# Altium project Hardware2_Smartwatch.PrjPcb (part 1 of 3)
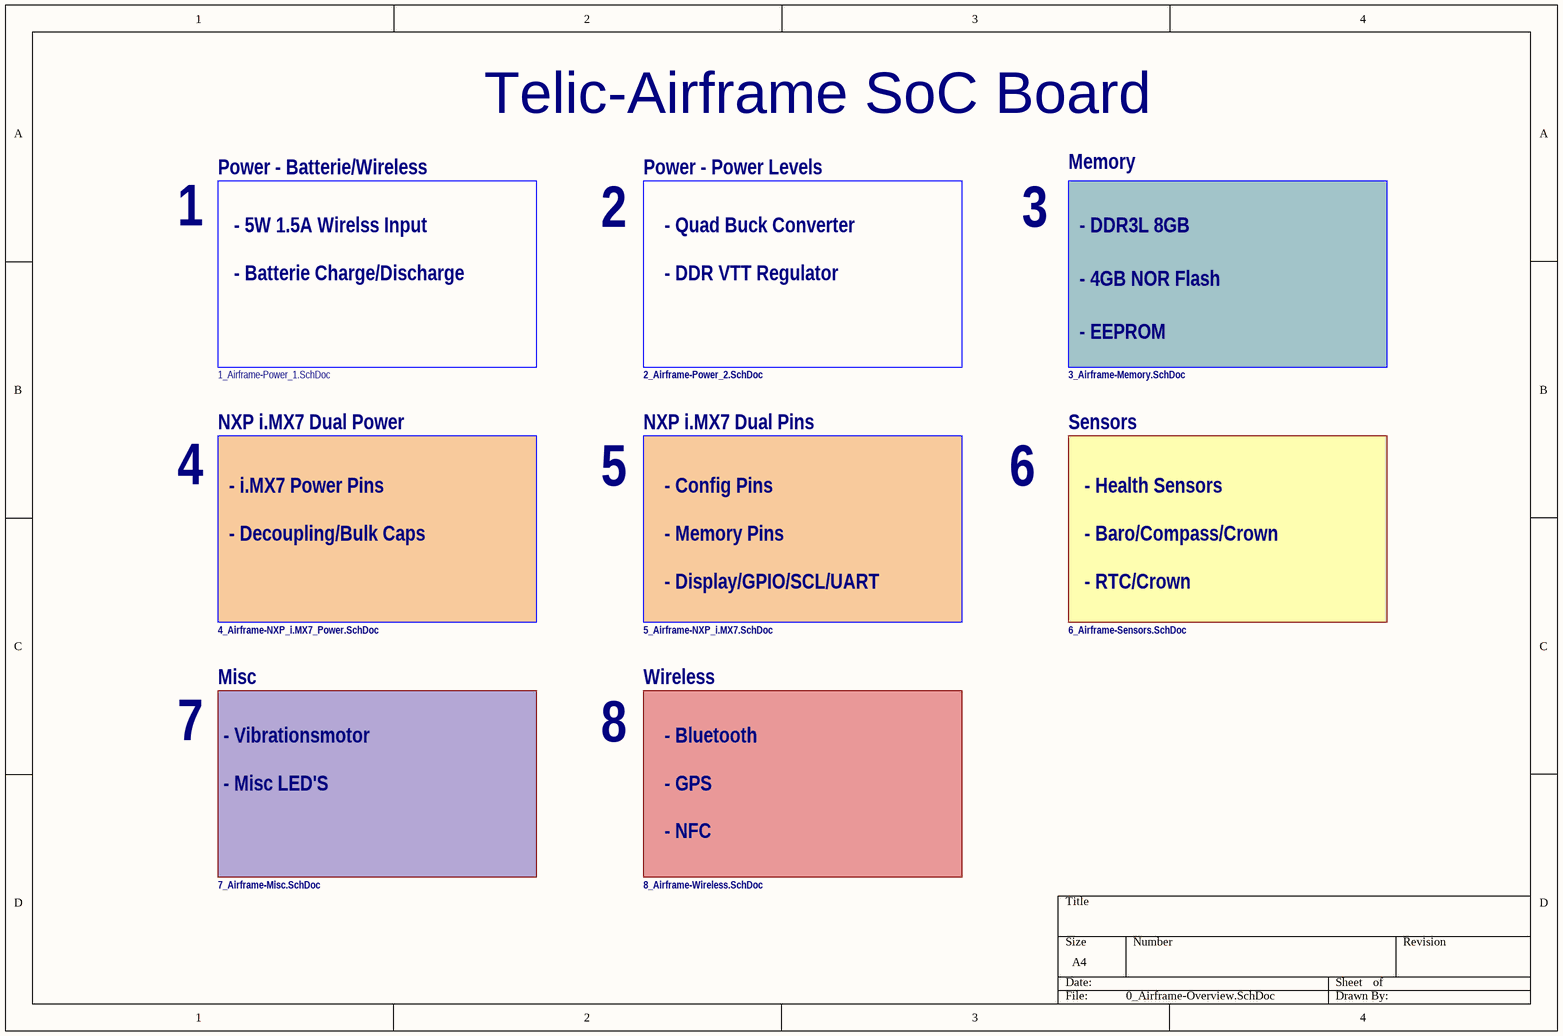
[diagram p0: 0_Airframe-Overview.SchDoc]
9 sheets, 277 parts. Net scope: global (net labels, ports and power ports of the same name join across sheets).
Board file: Prototype1.PcbDoc
Sheets:
  0_Airframe-Overview.SchDoc
  1_Airframe-Power_1.SchDoc
  2_Airframe-Power_2.SchDoc
  3_Airframe-Memory_1.SchDoc
  5_Airframe-NXP_i.MX7_Power.SchDoc
  6_Airframe-NXP_i.MX7.SchDoc
  7_Airframe-Sensors.SchDoc
  8_Airframe-Misc.SchDoc
  9_Airframe-Wireless.SchDoc

## Sheet 0_Airframe-Overview.SchDoc
size A4; SheetNumber: 1; SheetTotal: 9

### Notes on the sheet
- Power - Batterie/Wireless
- Telic-Airframe SoC Board
- Power - Power Levels
- Memory
- 1
- - 5W 1.5A Wirelss Input
- 2
- - Quad Buck Converter
- 3
- - DDR3L 8GB
- - Batterie Charge/Discharge
- - DDR VTT Regulator
- - 4GB NOR Flash
- 1_Airframe-Power_1.SchDoc
- 2_Airframe-Power_2.SchDoc
- 3_Airframe-Memory.SchDoc
- - EEPROM
- NXP i.MX7 Dual Power
- NXP i.MX7 Dual Pins
- Sensors
- 4
- - i.MX7 Power Pins
- 5
- - Config Pins
- 6
- - Health Sensors
- - Decoupling/Bulk Caps
- - Memory Pins
- - Baro/Compass/Crown
- 4_Airframe-NXP_i.MX7_Power.SchDoc
- 5_Airframe-NXP_i.MX7.SchDoc
- - Display/GPIO/SCL/UART
- 6_Airframe-Sensors.SchDoc
- - RTC/Crown
- Misc
- Wireless
- 7
- - Vibrationsmotor
- 8
- - Bluetooth
- - Misc LED'S
- - GPS
- - NFC
- 7_Airframe-Misc.SchDoc
- 8_Airframe-Wireless.SchDoc

## Sheet 1_Airframe-Power_1.SchDoc
size A4; SheetNumber: 2; SheetTotal: 9; SPICEModelCacheFLVJDJZP: <root> / <DocumentId>FLVJDJZP</DocumentId> / </root>
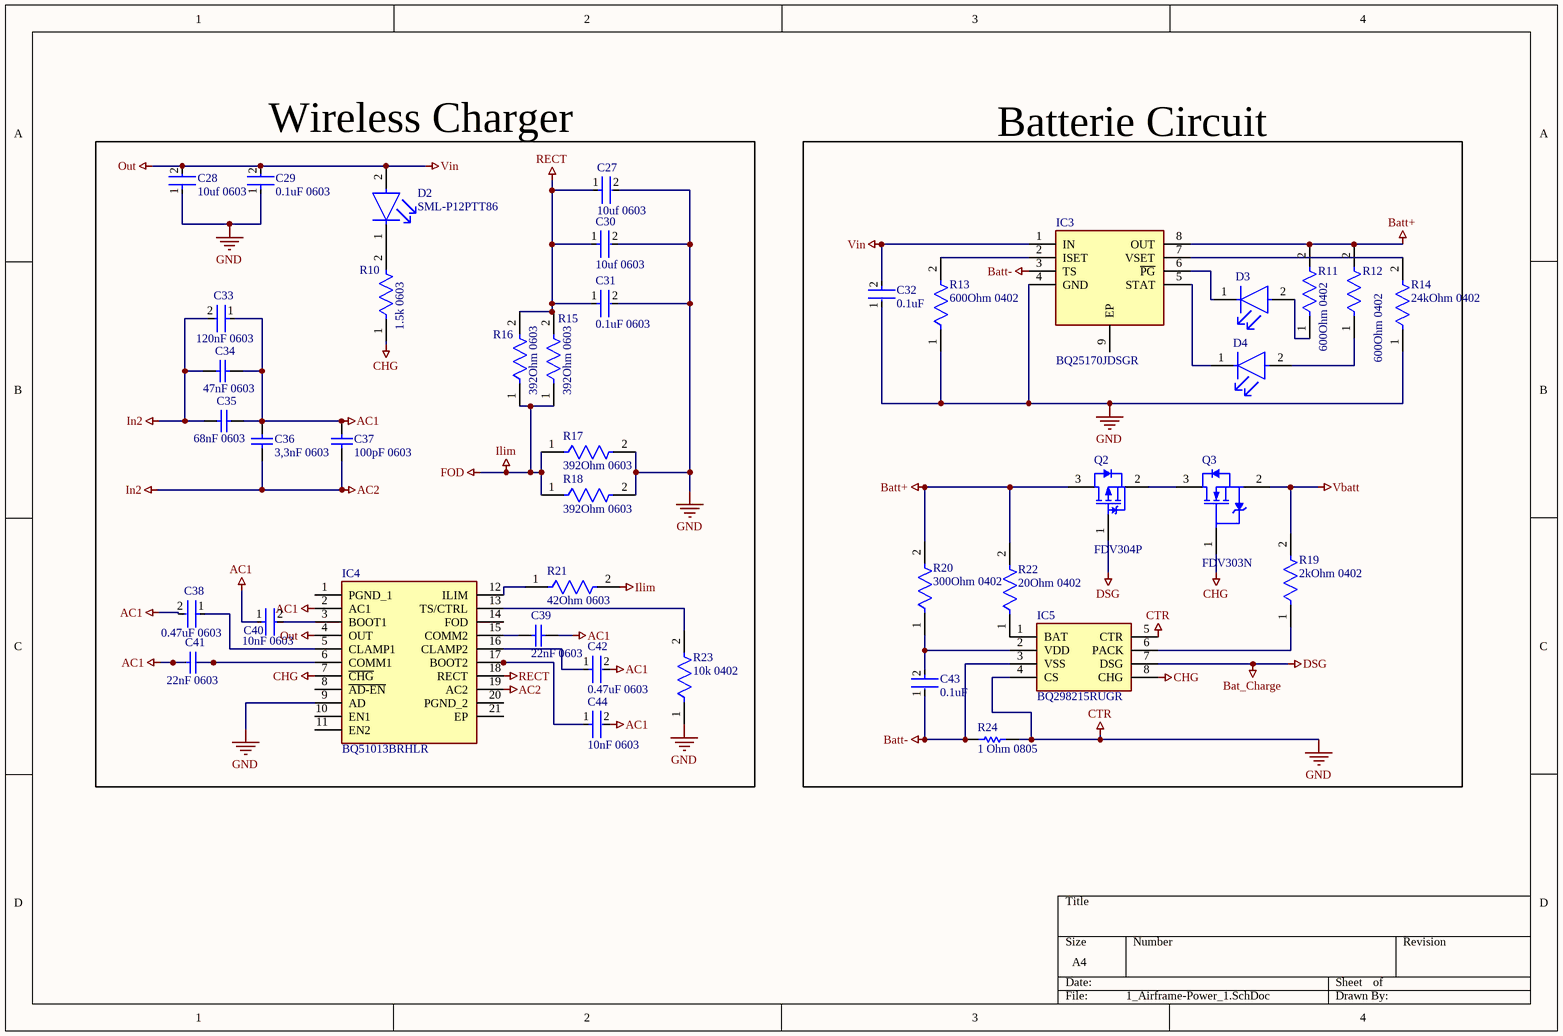
[diagram p1: 1_Airframe-Power_1.SchDoc]

### Parts
C27  10uf 0603  [FP-GRM188-0_1-e0_2_0_55-IPC_C]
C28  10uf 0603  [FP-GRM188-0_1-e0_2_0_55-IPC_C]
C29  0.1uF 0603  [FP-C0603C-CF-MFG]
C30  10uf 0603  [FP-GRM188-0_1-e0_2_0_55-IPC_C]
C31  0.1uF 0603  [FP-C0603C-CF-MFG]
C32  0.1uF  [FP-GRM15-MFG]
C33  120nF 0603  [FP-C0603C-CF-MFG]
C34  47nF 0603  [CAPC1608X90X35ML10T15]
C35  68nF 0603  [CAPC1608X90X35LL10T15]
C36  3,3nF 0603  [CAPC1608X90X35LL10T15]
C37  100pF 0603  [CAPC1608X90X35NL10T15]
C38  0.47uF 0603  [FP-GRM188-0_1-e0_2_0_5-IPC_A]
C39  22nF 0603  [CAPC1608X90X35ML10T15]
C40  10nF 0603  [FP-CC0603-DA-MFG]
C41  22nF 0603  [CAPC1608X90X35ML10T15]
C42  0.47uF 0603  [FP-GRM188-0_1-e0_2_0_5-IPC_A]
C43  0.1uF  [FP-GRM15-MFG]
C44  10nF 0603  [FP-CC0603-DA-MFG]
D2  SML-P12PTT86  [FP-SML-P1-MFG]
D3  SML-P12PTT86  [FP-SML-P1-MFG]  (value not drawn)
D4  SML-P12PTT86  [FP-SML-P1-MFG]  (value not drawn)
IC3  BQ25170JDSGR  [SON50P200X200X80-9N]
IC4  BQ51013BRHLR  [BQ51050BRHLR]
IC5  BQ298215RUGR  [BQ298215RUGR]
Q2  FDV304P  [FAIR-SOT23-3_V]
Q3  FDV303N  [FAIR-FDV303N-3_V]
R10  1.5k 0603  [FP-CRCW0402-e3-IPC_C]
R11  600Ohm 0402  [FP-CRCW0402-e3-IPC_C]
R12  600Ohm 0402  [FP-CRCW0402-e3-IPC_C]
R13  600Ohm 0402  [FP-CRCW0402-e3-IPC_C]
R14  24kOhm 0402  [FP-CRCW0402-e3-IPC_C]
R15  392Ohm 0603  [FP-CRCW0402-e3-IPC_C]
R16  392Ohm 0603  [FP-CRCW0402-e3-IPC_C]
R17  392Ohm 0603  [FP-CRCW0402-e3-IPC_C]
R18  392Ohm 0603  [FP-CRCW0402-e3-IPC_C]
R19  2kOhm 0402  [FP-CRCW0402-e3-IPC_C]
R20  300Ohm 0402  [FP-CRCW0402-e3-IPC_C]
R21  42Ohm 0603  [FP-CRCW0402-e3-IPC_C]
R22  20Ohm 0402  [FP-CRCW0402-e3-IPC_C]
R23  10k 0402  [FP-CRCW0402-e3-IPC_B]
R24  1 Ohm 0805  [RESC1609X50X30LL10T20]

### Nets
AC1: C33.1 C34.2 C35.2 C36.2 C37.2 C38.2 C39.2 C40.1 C41.2 C42.2 C44.2 IC4.2(AC1)
AC2: C33.2 C34.1 C35.1 C36.1 C37.1 IC4.19(AC2)  [also labelled In2]
Bat_Charge: IC5.7(DSG) Q2.1(G)  [also labelled DSG]
Batt+: IC3.8(OUT) Q2.3(D) R11.2 R12.2 R20.2 R22.2
Batt-: C43.1 IC3.3(TS) IC5.3(VSS) R24.1
CHG: IC4.7(~{CHG}) IC5.8(CHG) Q3.1(G) R10.1
CTR: C27.2 C28.1 C29.1 C30.2 C31.2 C32.1 IC3.4(GND) IC4.9(AD) IC5.4(CS) IC5.5(CTR) R13.1 R14.1 R17.2 R18.2 R23.1 R24.2  [also labelled GND]
FOD: R15.1 R16.1 R17.1 R18.1 R21.2  [also labelled Ilim]
Out: C28.2 C29.2 C32.2 D2.2(A) IC3.1(IN) IC4.4(OUT)  [also labelled Vin]
RECT: C27.1 C30.1 C31.1 IC4.18(RECT) R15.2 R16.2
Vbatt: Q3.2(S) R19.2
NetC38_1: C38.1 IC4.5(CLAMP1)
NetC39_1: C39.1 IC4.15(COMM2)
NetC40_2: C40.2 IC4.3(BOOT1)
NetC41_1: C41.1 IC4.6(COMM1)
NetC42_1: C42.1 IC4.16(CLAMP2)
NetC43_2: C43.2 IC5.2(VDD) R20.1
NetC44_1: C44.1 IC4.17(BOOT2)
NetD2_1: D2.1(C) R10.2
NetD3_1: D3.1(C) IC3.6(~{PG})
NetD3_2: D3.2(A) R11.1
NetD4_1: D4.1(C) IC3.5(STAT)
NetD4_2: D4.2(A) R12.1
NetIC3_2: IC3.2(ISET) R13.2
NetIC3_7: IC3.7(VSET) R14.2
NetIC4_12: IC4.12(ILIM) R21.1
NetIC4_13: IC4.13(TS/CTRL) R23.2
NetIC5_1: IC5.1(BAT) R22.1
NetIC5_6: IC5.6(PACK) R19.1
NetQ2_2: Q2.2(S) Q3.3(D)

Not connected (* = marked no-connect by the designer): IC3 9(EP); IC4 1(PGND_1) 8(~{AD-EN}) 10(EN1) 11(EN2) 14(FOD) 20(PGND_2) 21(EP)

### Notes on the sheet
- Wireless Charger
- Batterie Circuit

### Library data of the parts
C27 C28 C30 = CMP-2006-02792-2: Chip Multilayer Ceramic Capacitors for General Purpose, 0603, 10uF, X5R, 15%, 20%, 6.3V; Packaging: Tape and Reel; Voltage Rating (DC): 6.3V; Width: 0.031inch; Termination: SMD/SMT; Dielectric: X5R; Package Quantity: 4000; Voltage Rating: 6.3V; Capacitance: 10uF; Case/Package: 0603; Min Operating Temperature: -55°C; Voltage: 6.3V; Length: 1.6mm; Thickness: 0.035inch; Lead Free: Lead Free; Depth: 0.8mm; Case Code (Imperial): 0603; Max Operating Temperature: 85°C; Material: Ceramic; Height: 0.8mm; Tolerance: 20%; Mount: Surface Mount; REACH SVHC: No SVHC; Radiation Hardening: No; Case Code (Metric): 1608
C29 C31 = CMP-2006-03061-2: CAP CER 0.1UF 50V X7R 0603; Manufacturer: KEMET; Manufacturer Part Number: C0603C104K5RACTU; Tolerance: 0.1; Temperature Coefficient: 30ppm/°C; Material: Ceramic; Automotive Grade: Grade 1; Value: 0.10 μF; Temperature: -55°C to +125°C; RoHS: TRUE; Temperature Range High: +125°C; Lead Free: Yes; Octopart: https://octopart.com/c0603c104k5ractu-kemet-139244; Digikey Description: CAP CER 0.1UF 50V X7R 0603; Category: Cap; Package: C0603C-CF; ComponentLink2Description: Datasheet; Temperature Range Low: -55°C; Device Class L1: Passive Components; Voltage Rating: 50 V; Automotive: Yes; Device Class L3: Ceramic Capacitors; ComponentLink2URL: https://api.kemet.com/component-edge/download/datasheet/C0603C100J5GACAUTO.pdf; Capacitance: 0.10 μF; Device Class L2: Capacitors; Temperature Characteristic: X7R; Height: 0.87mm
C32 C43 = CMP-2100-03641-2: CAP CER 0.1UF 16V X7R 0402; Manufacturer Part Number: GRM155R71C104KA88D; Manufacturer: Murata; Standoff Height: 0mm; Tolerance: 10%; Voltage Rating: 16Vdc; Material: Ceramic; Capacitance: 0.10μF; Value: 0.10μF; RoHS: TRUE; Temperature Characteristic: X7R; Octopart: https://octopart.com/grm155r71c104ka88d-murata-196880; Digikey Description: CAP CER 0.1UF 16V X7R 0402; Device Class L3: Ceramic Capacitors; Height: 0.55mm; ComponentLink2Description: Datasheet; Temperature Range Low: -55°C; Ipc Land Pattern Name: CAPC10050X219; ComponentLink2URL: https://search.murata.co.jp/Ceramy/image/img/A01X/G101/ENG/GRM155R71H471KA01-01A.pdf; Device Class L1: Passive Components; Lead Free: yes; Category: Cap; Package: GRM15; Temperature: -55°C to +125°C; Device Class L2: Capacitors; Temperature Range High: +125°C; Mouser Description: 0402 0.1 uF 16V ±10 % Tolerance X7R SMT Multilayer Ceramic Capacitor
C33 = CMP-1035-02605-3: 0603 C 120nF Ceramic Multilayer Capacitor; 50 V; +125degC; X7R Dielec; +/-10%; Manufacturer: KEMET; Manufacturer Part Number: C0603C124K5RACTU; Capacitance: 0.12 μF; Automotive Grade: Grade 1; Voltage Rating: 50 V; Tolerance: 0.1; Temperature Coefficient: 30ppm/°C; Value: 0.12 μF; Device Class L2: Capacitors; Package: C0603C-CF; Digikey Description: 0603 C 120nF Ceramic Multilayer Capacitor; 50 V; +125degC; X7R Dielec; +/-10%; Device Class L3: Ceramic Capacitors; Category: Cap; Material: Ceramic; Height: 0.87mm; Temperature: -55°C to +125°C; Temperature Range High: +125°C; Temperature Characteristic: X7R; Lead Free: Yes; Automotive: Yes; ComponentLink2URL: https://api.kemet.com/component-edge/download/datasheet/C0603C100J5GACAUTO.pdf; Octopart: https://octopart.com/c0603c124k5ractu-kemet-12818104; Device Class L1: Passive Components; RoHS: TRUE; ComponentLink2Description: Datasheet; Temperature Range Low: -55°C
C34 = CMP-2006-02927-1: Manufacturer: Murata; Part Number: GRM188R71H473KA61D
C35 = CMP-2006-02937-1: Part Number: GRM188R71H683KA93D; Manufacturer: Murata
C36 = CMP-2006-02916-1: Manufacturer: Murata; Part Number: GRM188R71H332KA01D
C37 = CMP-2006-02595-1: Part Number: GRM1885C1H101JA01D; Manufacturer: Murata
C38 C42 = CMP-2006-02860-2: Chip Multilayer Ceramic Capacitors for General Purpose, 0603, 0.47uF, X7R, 15%, 10%, 16V; Capacitance: 470nF; Material: Ceramic; Termination: SMD/SMT; Case Code (Imperial): 0603; Height: 0.8mm; Dielectric: X7R; Length: 1.6mm; Packaging: Tape and Reel; Mount: Surface Mount; Thickness: 0.035inch; Voltage Rating (DC): 16V; Case Code (Metric): 1608; REACH SVHC: No SVHC; Depth: 0.8mm; Number of Pins: 2; Max Operating Temperature: 125°C; Min Operating Temperature: -55°C; Width: 0.8mm; Voltage: 16V; Lead Free: Lead Free; Voltage Rating: 16V; Package Quantity: 1; Case/Package: 0603; Tolerance: 10%
C39 C41 = CMP-2006-02910-1: Manufacturer: Murata; Part Number: GRM188R71H223KA01D
C40 C44 = CMP-2100-03600-2: CAP CER 10000PF 50V X7R 0603; Manufacturer Part Number: CC0603KRX7R9BB103; Manufacturer: YAGEO; Tolerance: 0.1; Material: Ceramic; Temperature Coefficient: 15%; Mouser Description: Multilayer Ceramic Capacitor, CC Series, 0.01 - F, - 10%, X7R, 50 V, 0603 [1608 Metric]; Digikey Description: CAP CER 10000PF 50V X7R 0603; Height: 0.9mm; Category: Cap; Temperature Characteristic: X7R; Footprint Url: http://www.yageo.com/exep/pages/download/literatures/UPY-C_GEN_24.pdf; Lead Free: Yes; Voltage Rating: 50 V; Temperature: -55°C to +125°C; Device Class L3: Ceramic Capacitors; ComponentLink2Description: Datasheet; Voltage: 50 V; Package: CC0603-DA; Octopart: https://octopart.com/cc0603krx7r9bb103-yageo-192938; Automotive: No; Temperature Range High: +125°C; Temperature Range Low: -55°C; Value: 10 nF; RoHS: TRUE; Device Class L1: Passive Components; ComponentLink2URL: http://www.yageo.com/documents/recent/UPY-GPHC_X7R_6.3V-to-50V_18.pdf; Device Class L2: Capacitors; Capacitance: 10 nF
D2-D4 = CMP-08952-000020-1: LED GREEN CLEAR 1006 SMD; Manufacturer: Rohm; Led Orientation: Top View; Wavelength: 560nm; Forward Current: 20mA; Reverse Voltage: 5V; Power Dissipation: 52mW; Forward Voltage: 2.1V; Luminous Intensity: 10mcd; Device Class L1: Optoelectronics; Digikey Description: LED GREEN CLEAR 1006 SMD; Lead Free: Yes; Manufacturer Part Number: SML-P12PTT86; Temperature Range High: +85°C; Octopart: https://octopart.com/sml-p12ptt86-rohm-9290705; Device Class L2: LEDs; Colour: Green; RoHS: TRUE; Height: 0.25mm; Automotive: No; Device Class L3: unset; Temperature Range Low: -40°C; ComponentLink2Description: Datasheet; Mouser Description: Standard LEDs - SMD SMD Green 13 mcd height=0.2; Category: Diode; ComponentLink2URL: https://www.rohm.com/datasheet/SML-P12DT(R); Temperature: -40°C to +85°C; Package: SML-P1
IC3 = BQ25170JDSGR: Integrated Circuit; Manufacturer_Name: Texas Instruments; Datasheet Link: https://www.ti.com/lit/ds/symlink/bq25170j.pdf?ts=1649696800811&ref_url=https%253A%252F%252Fwww.ti.com%252Fproduct%252FBQ25170J; Height: 0.8mm; Manufacturer_Part_Number: BQ25170JDSGR; Mouser Part Number: 595-BQ25170JDSGR; Mouser Price/Stock: https://www.mouser.co.uk/ProductDetail/Texas-Instruments/BQ25170JDSGR?qs=A6eO%252BMLsxmRHugWPcRNj7A%3D%3D; Arrow Part Number: BQ25170JDSGR; Arrow Price/Stock: https://www.arrow.com/en/products/bq25170jdsgr/texas-instruments?region=nac
IC4 = BQ51013BRHLR: Integrated Circuit; Manufacturer_Name: Texas Instruments; Datasheet Link: http://www.ti.com/lit/ds/symlink/bq51013b.pdf; Manufacturer_Part_Number: BQ51013BRHLR; Mouser Part Number: 595-BQ51013BRHLR; Mouser Price/Stock: https://www.mouser.co.uk/ProductDetail/Texas-Instruments/BQ51013BRHLR?qs=y1vSg4rOnUJlN8ZPg6D5Pw%3D%3D; Arrow Part Number: BQ51013BRHLR; Arrow Price/Stock: https://www.arrow.com/en/products/bq51013brhlr/texas-instruments?region=nac
IC5 = BQ298215RUGR: Integrated Circuit; Manufacturer_Name: Texas Instruments; Datasheet Link: https://www.arrow.com/en/products/bq298215rugr/texas-instruments?region=nac; Height: 0.4mm; Manufacturer_Part_Number: BQ298215RUGR; Mouser Part Number: 595-BQ298215RUGR; Mouser Price/Stock: https://www.mouser.co.uk/ProductDetail/Texas-Instruments/BQ298215RUGR?qs=iLbezkQI%252Bsg5V9tasAPYiQ%3D%3D; Arrow Part Number: BQ298215RUGR; Arrow Price/Stock: https://www.arrow.com/en/products/bq298215rugr/texas-instruments?region=nac
Q2 = CMP-2000-06263-1: P-Channel Digital FET, -25 V, -0.46 A, 0.35 W, -55 to 150 degC, 3-Pin SOT-23, -55 to 150 degC, RoHS, Tape and Reel; Manufacturer: FairchildSemiconductor; Rad Hard: No; Typical Fall Time: 35ns; Typical Rise Time: 8ns; Channel Mode: Enhancement; Maximum Continuous Drain Current: 0.46A; RDS-on: 1100@4.5VmOhm; Maximum Drain Source Voltage: 25V; Package Version: Rev. 12, 03/2016; Typical Turn-On Delay Time: 6ns; Maximum Gate Source Voltage: 8V; Channel Type: P; Typical Turn-Off Delay Time: 55ns; Datasheet Version: Rev. E1, 08/1997; Package Description: 3-Pin Small Outline Transistor, Body 2.92 x 1.325 mm, Pitch 0.95 mm; Operating Temperature: -55to150°C; Package Reference: SOT23-3; Manufacturer URL: https://www.fairchildsemi.com/; Package URL: http://www.fairchildsemi.com/dwg/MA/MA03D.pdf; Package: 3SOT-23; Category: MOSFET; Packaging: Tape&Reel; Mounting: SurfaceMount; Datasheet URL: https://www.fairchildsemi.com/datasheets/FD/FDV304P.pdf; Mounting Technology: SurfaceMount
Q3 = CMP-2000-05111-1: N-Channel MOSFET Transistor, 8 V VGSS, 25 V VDSS, 0.68 A, -55 to 150 degC, 3-Pin SOT23, RoHS, Tape and Reel; Manufacturer: Fairchild; Typical Turn-On Delay Time: 3ns; Channel Mode: Enhancement; RDS-on: 450@4.5VmOhm; Maximum Continuous Drain Current: 0.68A; Maximum Drain Source Voltage: 25V; Rad Hard: No; Typical Fall Time: 13ns; Channel Type: N; Typical Turn-Off Delay Time: 17ns; Maximum Gate Source Voltage: 8V; Typical Rise Time: 8.5ns; Mounting: SurfaceMount; Packaging: Tape&Reel; Manufacturer URL: https://www.fairchildsemi.com/; Datasheet URL: https://datasheet.ciiva.com/22681/1845307-22681736.pdf; Package: 3SOT-23; Category: MOSFET; Operating Temperature: -55to150degC; Datasheet Version: Rev. D2, 07/2014
R10 R15-R18 R21 = CMP-2002-08122-2: RES Thick Film, 0Ω, 0.063W, 0402; Tolerance: 5%; Max Power Dissipation: 63mW; Voltage Rating: 50V; Temperature Coefficient: 100ppm/°C; Resistance: 0mR; Contact Plating: Tin; Height: 0.35mm; Radiation Hardening: No; Features: Automotive AEC-Q200; Composition: Thick Film; Width: 0.5mm; Weight: 2.3E-05oz; Termination: SMD/SMT; Packaging: Tape and Reel; Mount: Surface Mount; Case Code (Metric): 1005; Military Standard: Not; Min Operating Temperature: -55°C; Number of Terminations: 2; Package Quantity: 1; Case Code (Imperial): 0402; Depth: 0.5mm; Max Operating Temperature: 155°C; Case/Package: 0402; Power Rating: 63mW; Lead Free: Lead Free; Voltage Rating (DC): 50V; Length: 1mm
R11-R14 R19 R20 R22 = CMP-2002-08359-2: RES Thick Film, 20Ω, 1%, 0.063W, 100ppm/°C, 0402; Resistance: 20R; Voltage Rating: 50V; Max Power Dissipation: 63mW; Mount: Surface Mount; Packaging: Tape and Reel; Military Standard: Not; Height: 0.35mm; Depth: 0.5mm; Lead Free: Lead Free; Number of Terminations: 2; Contact Plating: Tin; Max Operating Temperature: 155°C; Package Quantity: 10; Termination: SMD/SMT; Min Operating Temperature: -55°C; Features: Automotive AEC-Q200; Radiation Hardening: No; Case Code (Metric): 1005; Width: 0.02inch; Composition: Thick Film; Case/Package: 0402; Case Code (Imperial): 0402; Temperature Coefficient: 100ppm/°C; Tolerance: 1%; Power Rating: 63mW; Voltage Rating (DC): 50V; Length: 1mm; Weight: 2.3E-05oz
R23 = CMP-2002-08135-2: RES SMD 10K OHM 1% 1/16W 0402; Power Rating: 63mW; Resistance: 10kR; Voltage Rating: 50V; Temperature Coefficient: 100ppm/°C; Case Code (Metric): 1005; Features: Automotive AEC-Q200; Termination: SMD/SMT; Mount: Surface Mount; Package Quantity: 10; Packaging: Tape and Reel; Case Code (Imperial): 0402; Weight: 2.3E-05oz; Lead Free: Lead Free; Width: 0.02inch; Max Power Dissipation: 63mW; Tolerance: 1%; Number of Terminations: 2; Height: 0.35mm; Number of Pins: 2; Composition: Thick Film; Length: 1mm; Voltage Rating (DC): 50V; Case/Package: 0402; Radiation Hardening: No; Contact Plating: Tin; Depth: 0.5mm; Military Standard: Not; Min Operating Temperature: -55°C; Max Operating Temperature: 155°C
R24 = CMP-1012-00171-2: Manufacturer: Vishay Dale; Part Number: CRCW06031R00FKEA

## Sheet 2_Airframe-Power_2.SchDoc
size A3; SheetNumber: 3; SheetTotal: 9
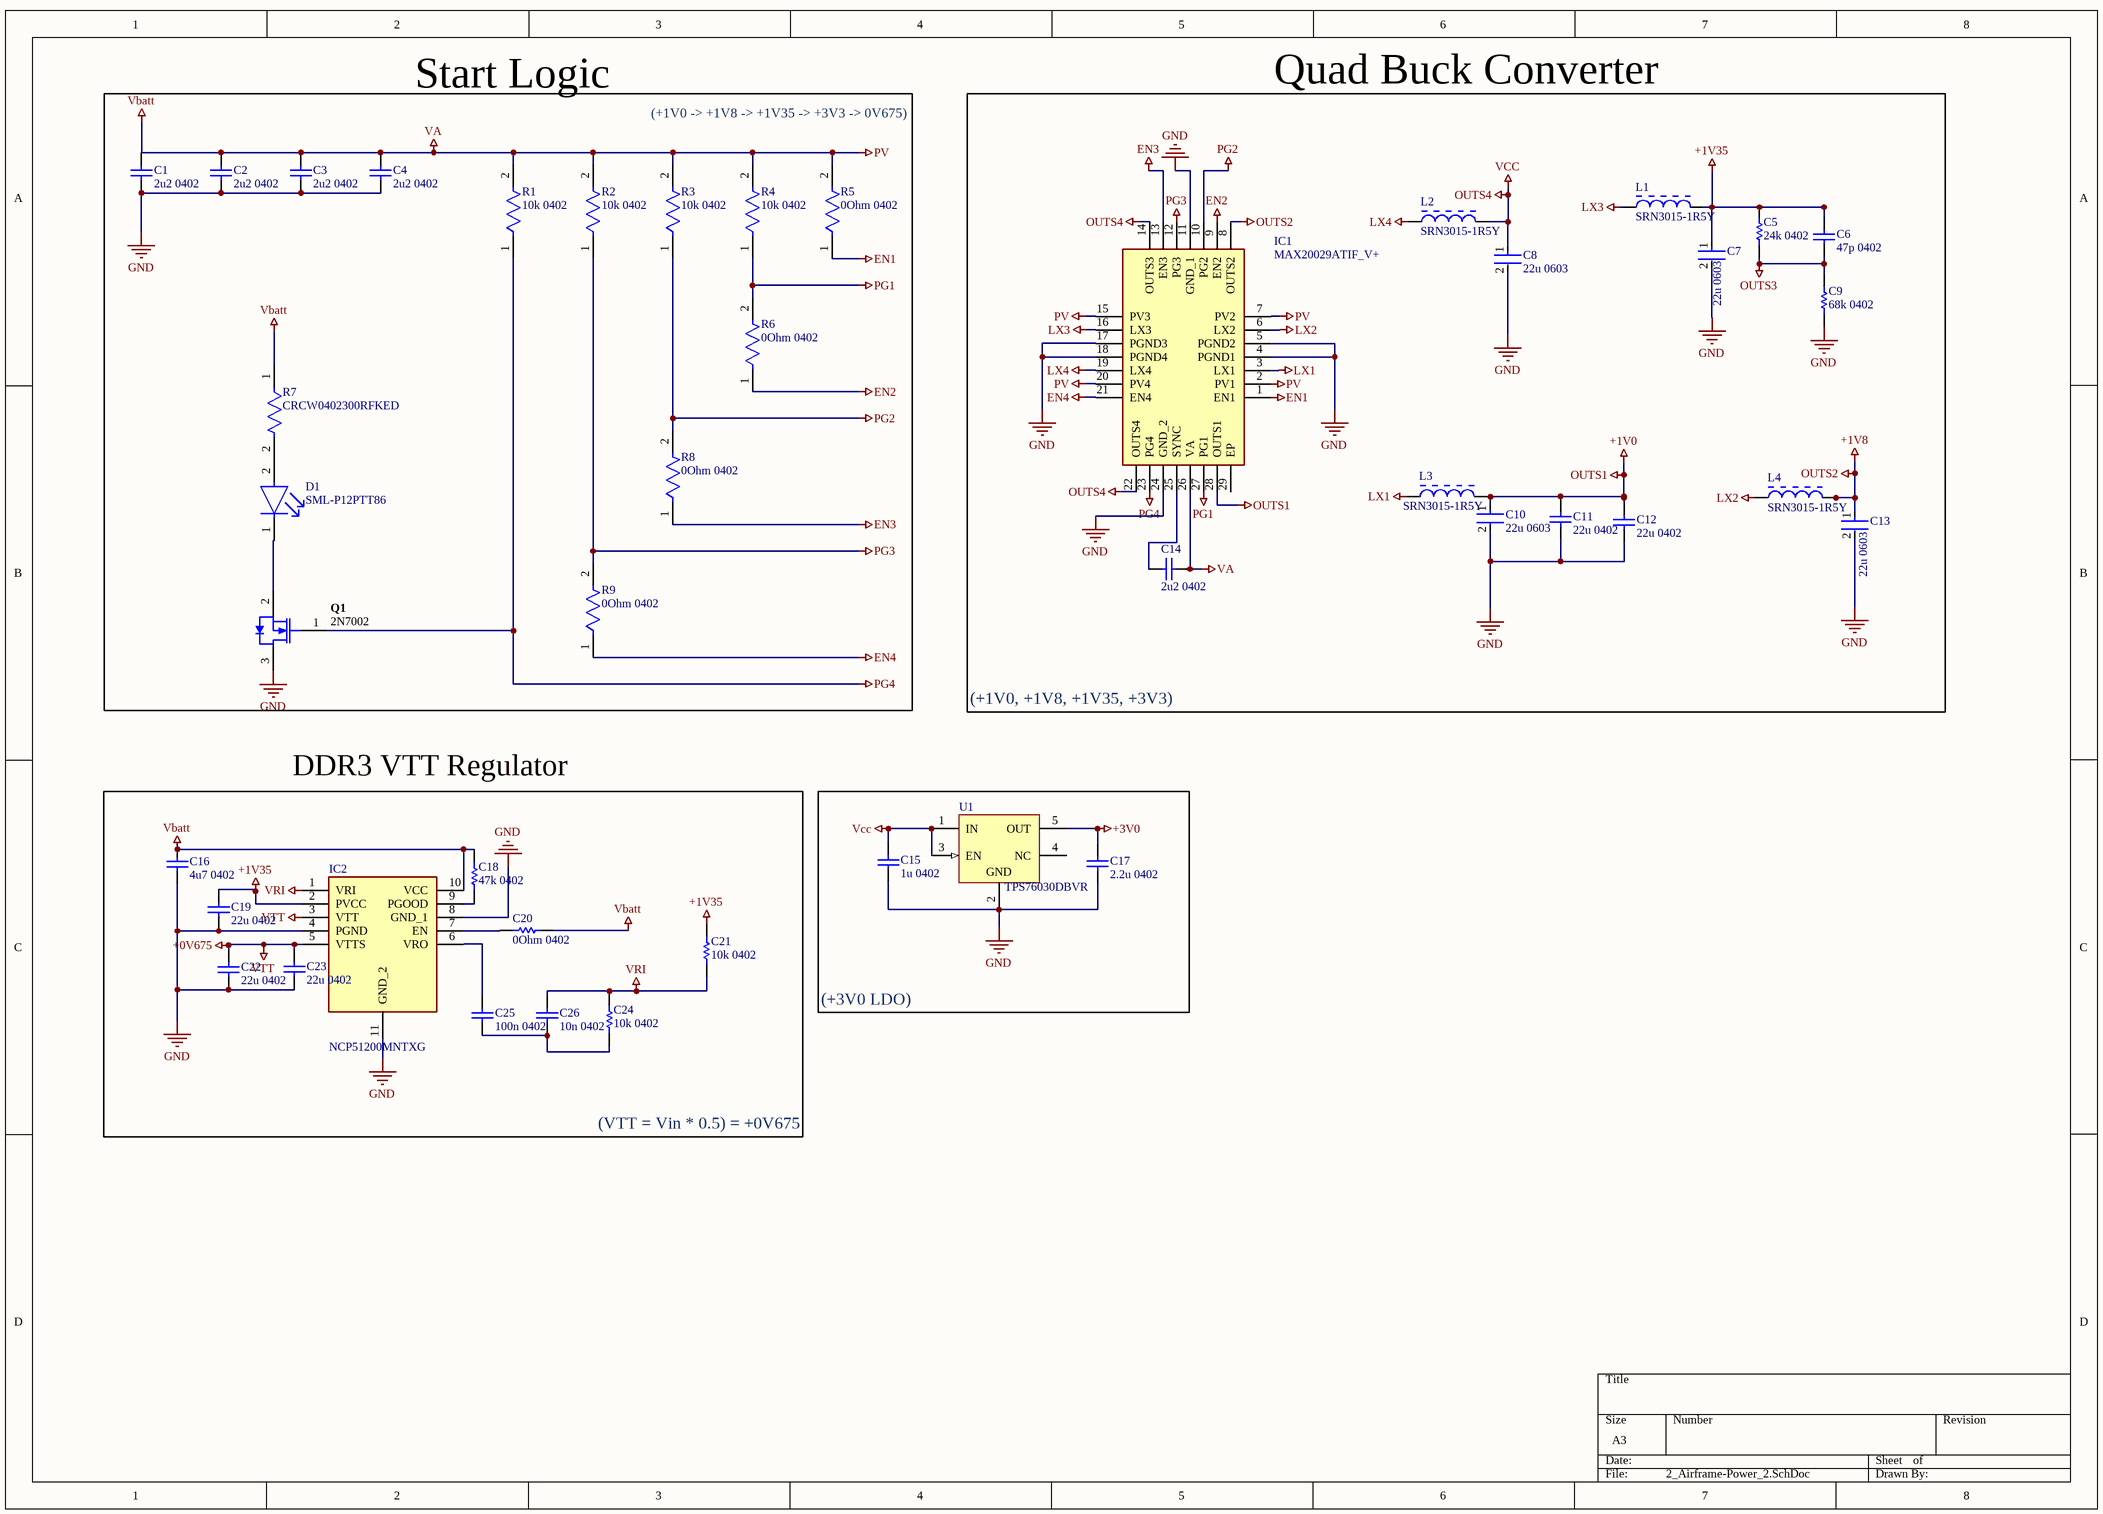
[diagram p2: 2_Airframe-Power_2.SchDoc]

### Parts
C1  2u2 0402  [CAPC1005X55X25ML5T10]
C2  2u2 0402  [CAPC1005X55X25ML5T10]
C3  2u2 0402  [CAPC1005X55X25ML5T10]
C4  2u2 0402  [CAPC1005X55X25ML5T10]
C5  24k 0402  [RESC1608X55X25ML10T15]
C6  47p 0402  [CAPC1005X55X25ML5T10]
C7  22u 0603  [FP-GRM188-0_2-IPC_C]
C8  22u 0603  [FP-GRM188-0_2-IPC_C]
C9  68k 0402  [RESC1608X55X25ML10T15]
C10  22u 0603  [FP-GRM188-0_2-IPC_C]
C11  22u 0402  [CAPC1005X55X25ML5T10]
C12  22u 0402  [CAPC1005X55X25ML5T10]
C13  22u 0603  [FP-GRM188-0_2-IPC_C]
C14  2u2 0402  [CAPC1005X55X25ML5T10]
C15  1u 0402  [CAPC1005X55X25ML5T10]
C16  4u7 0402  [CAPC1005X55X25ML5T10]
C17  2.2u 0402  [CAPC1005X55X25ML5T10]
C18  47k 0402  [RESC1608X55X25ML10T15]
C19  22u 0402  [CAPC1005X55X25ML5T10]
C20  0Ohm 0402  [RESC1608X55X25ML10T15]
C21  10k 0402  [RESC1608X55X25ML10T15]
C22  22u 0402  [CAPC1005X55X25ML5T10]
C23  22u 0402  [CAPC1005X55X25ML5T10]
C24  10k 0402  [RESC1608X55X25ML10T15]
C25  100n 0402  [CAPC1005X55X25ML5T10]
C26  10n 0402  [CAPC1005X55X25ML5T10]
D1  SML-P12PTT86  [FP-SML-P1-MFG]
IC1  MAX20029ATIF_V+  [QFN50P500X500X80-29N]
IC2  NCP51200MNTXG  [SON50P300X300X100-11N]
L1  SRN3015-1R5Y  [BOUR-SRN3015-2_V]
L2  SRN3015-1R5Y  [BOUR-SRN3015-2_V]
L3  SRN3015-1R5Y  [BOUR-SRN3015-2_V]
L4  SRN3015-1R5Y  [BOUR-SRN3015-2_V]
Q1  2N7002  [INF-PG-SOT23_N]
R1  10k 0402  [FP-CRCW0402-e3-IPC_C]
R2  10k 0402  [FP-CRCW0402-e3-IPC_C]
R3  10k 0402  [FP-CRCW0402-e3-IPC_C]
R4  10k 0402  [FP-CRCW0402-e3-IPC_C]
R5  0Ohm 0402  [FP-CRCW0402-e3-IPC_C]
R6  0Ohm 0402  [FP-CRCW0402-e3-IPC_C]
R7  CRCW0402300RFKED  [FP-CRCW0402-e3-MFG]
R8  0Ohm 0402  [FP-CRCW0402-e3-IPC_C]
R9  0Ohm 0402  [FP-CRCW0402-e3-IPC_C]
U1  TPS76030DBVR  [DBV0005A_N]

### Blocks framed on the sheet
(+1V0 -> +1V8 -> +1V35 -> +3V3 -> 0V675): C1-C4 D1 Q1 R1-R9
(+1V0, +1V8, +1V35, +3V3): C5-C14 IC1 L1-L4
(VTT = Vin * 0.5) = +0V675: C16 C18-C26 IC2
(+3V0 LDO): C15 C17 U1

### Nets
+0V675: C22.1 C23.1 IC2.3(VTT) IC2.5(VTTS)  [also labelled VTT]
+1V0: C10.1 C11.1 C12.1 IC1.28(OUTS1) L3.2  [also labelled OUTS1]
+1V8: C13.1 IC1.8(OUTS2) L4.2  [also labelled OUTS2]
+1V35: C5.2 C6.1 C7.1 C19.1 C21.1 IC2.2(PVCC) L1.2
+3V0: C17.1 U1.5(OUT)
EN1: IC1.1(EN1) R5.1
EN2: IC1.9(EN2) R6.1
EN3: IC1.13(EN3) R8.1
EN4: IC1.21(EN4) R9.1
GND: C1.2 C2.2 C3.2 C4.2 C7.2 C8.2 C9.1 C10.2 C11.2 C12.2 C13.2 C15.2 C16.2 C17.2 C19.2 C22.2 C23.2 IC1.4(PGND1) IC1.5(PGND2) IC1.11(GND_1) IC1.17(PGND3) IC1.18(PGND4) IC1.24(GND_2) IC2.4(PGND) IC2.8(GND_1) IC2.11(GND_2) Q1.3(DRAIN) U1.2(GND)  [project net CTR]
LX1: IC1.3(LX1) L3.1
LX2: IC1.6(LX2) L4.1
LX3: IC1.16(LX3) L1.1
LX4: IC1.19(LX4) L2.1
OUTS3: C5.1 C6.2 C9.2
OUTS4: C8.1 C15.1 IC1.14(OUTS3) IC1.22(OUTS4) L2.2 U1.1(IN) U1.3(EN)  [also labelled VCC]  [project net +VS]
PG1: IC1.27(PG1) R4.1 R6.2
PG2: IC1.10(PG2) R3.1 R8.2
PG3: IC1.12(PG3) R2.1 R9.2
PG4: IC1.23(PG4) Q1.1(GATE) R1.1
PV: C1.1 C2.1 C3.1 C4.1 C14.1 IC1.2(PV1) IC1.7(PV2) IC1.15(PV3) IC1.20(PV4) IC1.26(VA) R1.2 R2.2 R3.2 R4.2 R5.2  [also labelled VA]
Vbatt: C16.1 C18.2 C20.1 IC2.10(VCC) R7.1
VRI: C21.2 C24.1 C26.1 IC2.1(VRI)
NetC14_2: C14.2 IC1.25(SYNC)
NetC18_1: C18.1 IC2.9(PGOOD)
NetC20_2: C20.2 IC2.7(EN)
NetC24_2: C24.2 C25.2 C26.2
NetC25_1: C25.1 IC2.6(VRO)
NetD1_1: D1.1(C) Q1.2(SOURCE)
NetD1_2: D1.2(A) R7.2

Not connected (* = marked no-connect by the designer): IC1 29(EP); U1 4(NC)

### Notes on the sheet
- Start Logic
- Quad Buck Converter
- DDR3 VTT Regulator

### Library data of the parts
C1-C4 C6 C11 C12 C14-C17 C19 C22 C23 C25 C26 = CMP-1662-00017-1: Chip Capacitor, 1 nF, +/- 10%, 50 V, -55 to 125 degC, 0402 (1005 Metric), RoHS, Tape and Reel; Case\/Package: 0402; Type (Capacitors): X7R; Voltage Rating (DC): 50 V; Capacitance: 1 nF; Width: 0.5 mm; Pins: 2; REACH SVHC: No SVHC; Length: 1 mm; Height: 0.5 mm; PackageDescription: 2-Pin Surface Mount Device, Body 1 x 0.5 mm; DatasheetVersion: 07/2016; Mount: Surface Mount; ComponentLink2Description: Datasheet; Tolerance: 10%; ComponentLink2URL: http://psearch.en.murata.com/capacitor/product/GRM155R71H102KA01%23.pdf; ComponentLink1URL: http://www.murata.com/; Case Code (Metric): 1005; Package Quantity: 10000; Min Operating Temperature: -55 degC; Max Operating Temperature: 125 degC; Voltage Rating: 50 V; ComponentLink1Description: Manufacturer URL; Packaging: Tape and Reel; Radiation Hardening: No; RoHSCompliant: true; PackageReference: 0402; Mounting Technology: Surface Mount; Case Code (Imperial): 0402
C5 C9 C18 C20 C21 C24 = CMP-2100-03667-1: Chip Resistor, 0 Ohm, +/- 5%, 0.1 W, -55 to 155 degC, 0603 (1608 Metric), RoHS, Tape and Reel; Manufacturer: Yageo; Temperature Coefficient: 200ppm/degreesC; Voltage Rating: 50V; Power Rating: 100mW; Resistance: 0mOhm; Width: 0.8mm; Max Operating Temperature: 155degC; Tolerance: 5%; Package Reference: 0603; Height: 0.45mm; Depth: 0.8mm; Package Description: 2-Pin Surface Mount Device, Body 1.6 x 0.8 mm; Termination: SMD/SMT; Package Quantity: 5000; Case/Package: 0603; Case Code (Imperial): 0603; Radiation Hardening: No; Number of Pins: 2; Length: 1.6mm; Lead Free: LeadFree; Voltage Rating (DC): 50V; Military Standard: Not; Datasheet URL: http://www.yageo.com/NewPortal/yageodocoutput?fileName=/pdf/R-Chip/PYu-RC_Group_51_RoHS_L_5.pdf; Manufacturer URL: http://www.yageo.com/; Packaging: TapeandReel; Case Code (Metric): 1608; Min Operating Temperature: -55degC; Composition: ThickFilm; RoHSCompliant: true; Contact Plating: Tin; Datasheet Version: Rev. 5, 10/2016; REACH SVHC: NoSVHC
C7 C8 C10 C13 = CMP-2000-06337-3: Chip Multilayer Ceramic Capacitors for General Purpose, 0603, 22uF, X5R, 15%, 20%, 10V; Tolerance: 20%; Weight: 0.000222oz; Material: Ceramic; Depth: 0.8mm; Length: 1.6mm; Termination: SMD/SMT; Capacitance: 22uF; Packaging: Tape and Reel; Width: 0.8mm; Voltage Rating: 10V; Case Code (Imperial): 0603; Mount: Surface Mount; Voltage Rating (DC): 10V; Case/Package: 0603; Thickness: 0.039inch; REACH SVHC: No SVHC; Dielectric: X5R; Height: 0.8mm; Package Quantity: 4000; Case Code (Metric): 1608; Min Operating Temperature: -55°C; Lead Free: Lead Free; Max Operating Temperature: 85°C
D1 = CMP-08952-000020-1: as D2 on sheet 1_Airframe-Power_1; Device Class L1: Optoelectronics; Digikey Description: LED GREEN CLEAR 1006 SMD; Lead Free: Yes; Manufacturer Part Number: SML-P12PTT86; Temperature Range High: +85°C; Octopart: https://octopart.com/sml-p12ptt86-rohm-9290705; Device Class L2: LEDs; Colour: Green; RoHS: TRUE; Height: 0.25mm; Automotive: No; Device Class L3: unset; Temperature Range Low: -40°C; ComponentLink2Description: Datasheet; Mouser Description: Standard LEDs - SMD SMD Green 13 mcd height=0.2; Category: Diode; ComponentLink2URL: https://www.rohm.com/datasheet/SML-P12DT(R); Temperature: -40°C to +85°C; Package: SML-P1
IC1 = MAX20029ATIF_V+: Integrated Circuit; Manufacturer_Name: Maxim Integrated; Manufacturer_Part_Number: MAX20029ATIF/V+; Datasheet Link: https://datasheets.maximintegrated.com/en/ds/MAX20029-MAX20029D.pdf; Height: 0.8mm; Mouser Part Number: 700-MAX20029ATIF/V+; Mouser Price/Stock: https://www.mouser.co.uk/ProductDetail/Maxim-Integrated/MAX20029ATIF-V%2b?qs=uwxL4vQweFOl5TBKmLtmFg%3D%3D; Arrow Part Number: MAX20029ATIF/V+; Arrow Price/Stock: https://www.arrow.com/en/products/max20029atifv/maxim-integrated?region=nac
IC2 = NCP51200MNTXG: Integrated Circuit; Manufacturer_Name: onsemi; Datasheet Link: http://www.onsemi.com/pub/Collateral/NCP51200-D.PDF; Height: 1mm; Manufacturer_Part_Number: NCP51200MNTXG; Mouser Part Number: 863-NCP51200MNTXG; Mouser Price/Stock: https://www.mouser.co.uk/ProductDetail/onsemi/NCP51200MNTXG?qs=mt7EBqA2jzgnxcGILBvARw%3D%3D; Arrow Part Number: NCP51200MNTXG; Arrow Price/Stock: https://www.arrow.com/en/products/ncp51200mntxg/on-semiconductor?region=europe
L1-L4 = CMP-0007-00008-1: Semi-shielded Power Inductor, 1.5 uH, +/- 30%, 2.1 A, -40 to 125 degC, 3 x 3 x 1.5 mm SMD, RoHS and Halogen Free, Tape and Reel; Manufacturer: Bourns; SRF Min: 130 MHz; Rated current: 2.1 A; DCR Max: 0.066 Ohm; Inductance: 1.5 uH; Isat: 2 A; Inductance tolerance: +/- 30%; Resistance to Solder Heat: +260 degC for 10 sec.; RoHS: TRUE; Mounting Technology: Surface Mount; ComponentLink1Description: Manufacturer URL; ComponentLink1URL: http://www.bourns.com/; PartNumber: SRN3015-1R5Y; ComponentLink3Description: Package Specification; ComponentLink3URL: http://www.bourns.com/data/global/pdfs/SRN3015.pdf; Operating Temperature: -40 to 125 degC; PackageReference: SRN3015; DatasheetVersion: Aug-11; Packing: Tape and Reel; ComponentLink2Description: Datasheet; PackageDescription: 2-Pin SMD, Body 3 x 3 mm, Height 1.5 mm; ComponentLink2URL: http://www.bourns.com/data/global/pdfs/SRN3015.pdf
Q1 = CMP-1149-00026-1: N-Channel OptiMOS Small-Signal-Transistor, 60 V VDS, 0.3 A ID, -55 to 150 degC, PG-SOT23, Reel, Green; Manufacturer: Infineon; RDS (on) (max) (@4.5V): 4,000 mOhm; VDS (max): 60 V; IDpuls (max): 1.2Â A; QG: 0.4Â nC; RDS (on) (max): 3,000 mOhm; RthJA (max): 250 K/W; ID (max): 0.3Â A; VGS(th) (max): 2.5Â V; VGS(th) (min): 1.5Â V; Green: TRUE; Ptot (max): 0.5Â W; PackageDescription: 3-Pin Small Outline Transistor Package, 2.9 x 1.3 mm Body, 0.95 mm Pitch; Halogen-free: TRUE; ComponentLink2Description: Datasheet; ComponentLink1URL: http://www.infineon.com/; Packing: Reel; DatasheetVersion: Rev. 2.4; PartNumber: 2N7002; PackageReference: PG-SOT23; PackageVersion: Apr-08; ComponentLink3URL: http://www.infineon.com/dgdl/SOT23-Package_Overview.pdf?folderId=db3a30431936bc4b0119532290053c66&fileId=db3a30431936bc4b0119533468123c85; ComponentLink1Description: Manufacturer URL; Mounting Technology: Surface Mount; ComponentLink3Description: Package Specification; ComponentLink2URL: http://www.infineon.com/dgdl/2N7002_Rev2.4.pdf?folderId=db3a3043156fd573011622e10b5c1f67&fileId=db3a304319bc939a0119c2a9461e79e6
R1-R6 R8 R9 = CMP-2002-08122-2: as R10 on sheet 1_Airframe-Power_1; Contact Plating: Tin; Height: 0.35mm; Radiation Hardening: No; Features: Automotive AEC-Q200; Composition: Thick Film; Width: 0.5mm; Weight: 2.3E-05oz; Termination: SMD/SMT; Packaging: Tape and Reel; Mount: Surface Mount; Case Code (Metric): 1005; Military Standard: Not; Min Operating Temperature: -55°C; Number of Terminations: 2; Package Quantity: 1; Case Code (Imperial): 0402; Depth: 0.5mm; Max Operating Temperature: 155°C; Case/Package: 0402; Power Rating: 63mW; Lead Free: Lead Free; Voltage Rating (DC): 50V; Length: 1mm
R7 = CMP-2002-08497-2: RES Thick Film, 300Ω, 1%, 0.063W, 100ppm/°C, 0402; Voltage Rating: 50V; Resistance: 300R; Max Power Dissipation: 63mW; Depth: 0.5mm; Tolerance: 1%; Package Quantity: 10; Temperature Coefficient: 100ppm/°C; Features: Automotive AEC-Q200; Military Standard: Not; Case Code (Metric): 1005; Voltage Rating (DC): 50V; Case/Package: 0402; Lead Free: Lead Free; Contact Plating: Tin; Min Operating Temperature: -55°C; Length: 1mm; Number of Terminations: 2; Case Code (Imperial): 0402; Weight: 2.3E-05oz; Mount: Surface Mount; Termination: SMD/SMT; Max Operating Temperature: 155°C; Width: 0.02inch; Composition: Thick Film; Height: 0.35mm; Power Rating: 63mW; Radiation Hardening: No; Packaging: Tape and Reel
U1 = CMP-0394-00493-2: Single Output LDO, 50 mA, Fixed 3 V Output, 3.2 to 16 V Input, with Low IQ, 5-pin SOT-23 (DBV), -40 to 125 degC, Green (RoHS & no Sb/Br); Manufacturer: Texas Instruments; Accuracy(%): 2; Vin(Max)(V): 16; Iq(Typ)(mA): 0.8; Iout(Max)(A): 0.05; Vin(Min)(V): 3.2; Vout Adj(Max)(V): 3; SubFamily: Single Channel LDO; Vdo(Typ)(mV): 120; Rating: Catalog; ComponentLink1URL: http://www.ti.com/; ComponentLink1Description: Manufacturer URL; Code_JEDEC: MO-178; PackageDescription: 5-Pin Plastic Small Outline, Body 1.60 Ãƒâ€” 2.90 mm, Pitch 0.95 mm; PartNumber: TPS76030DBVR; ComponentLink2Description: Datasheet; Mounting Technology: Surface Mount; ComponentLink3Description: Package Specification; ComponentLink2URL: http://www.ti.com/general/docs/lit/getliterature.tsp?genericPartNumber=TPS76030&fileType=pdf; ComponentLink3URL: http://www.ti.com/litv/pdf/mpds018i; Eco-Plan: Green (RoHS & no Sb/Br); DatasheetVersion: SLVS144D; PackageVersion: 4073253-4/K; Fixed Output Options(V): 3; Vout Adj(Min)(V): 3; PackageReference: DBV0005A

## Sheet 3_Airframe-Memory_1.SchDoc
size A3; SheetNumber: 4; SheetTotal: 9
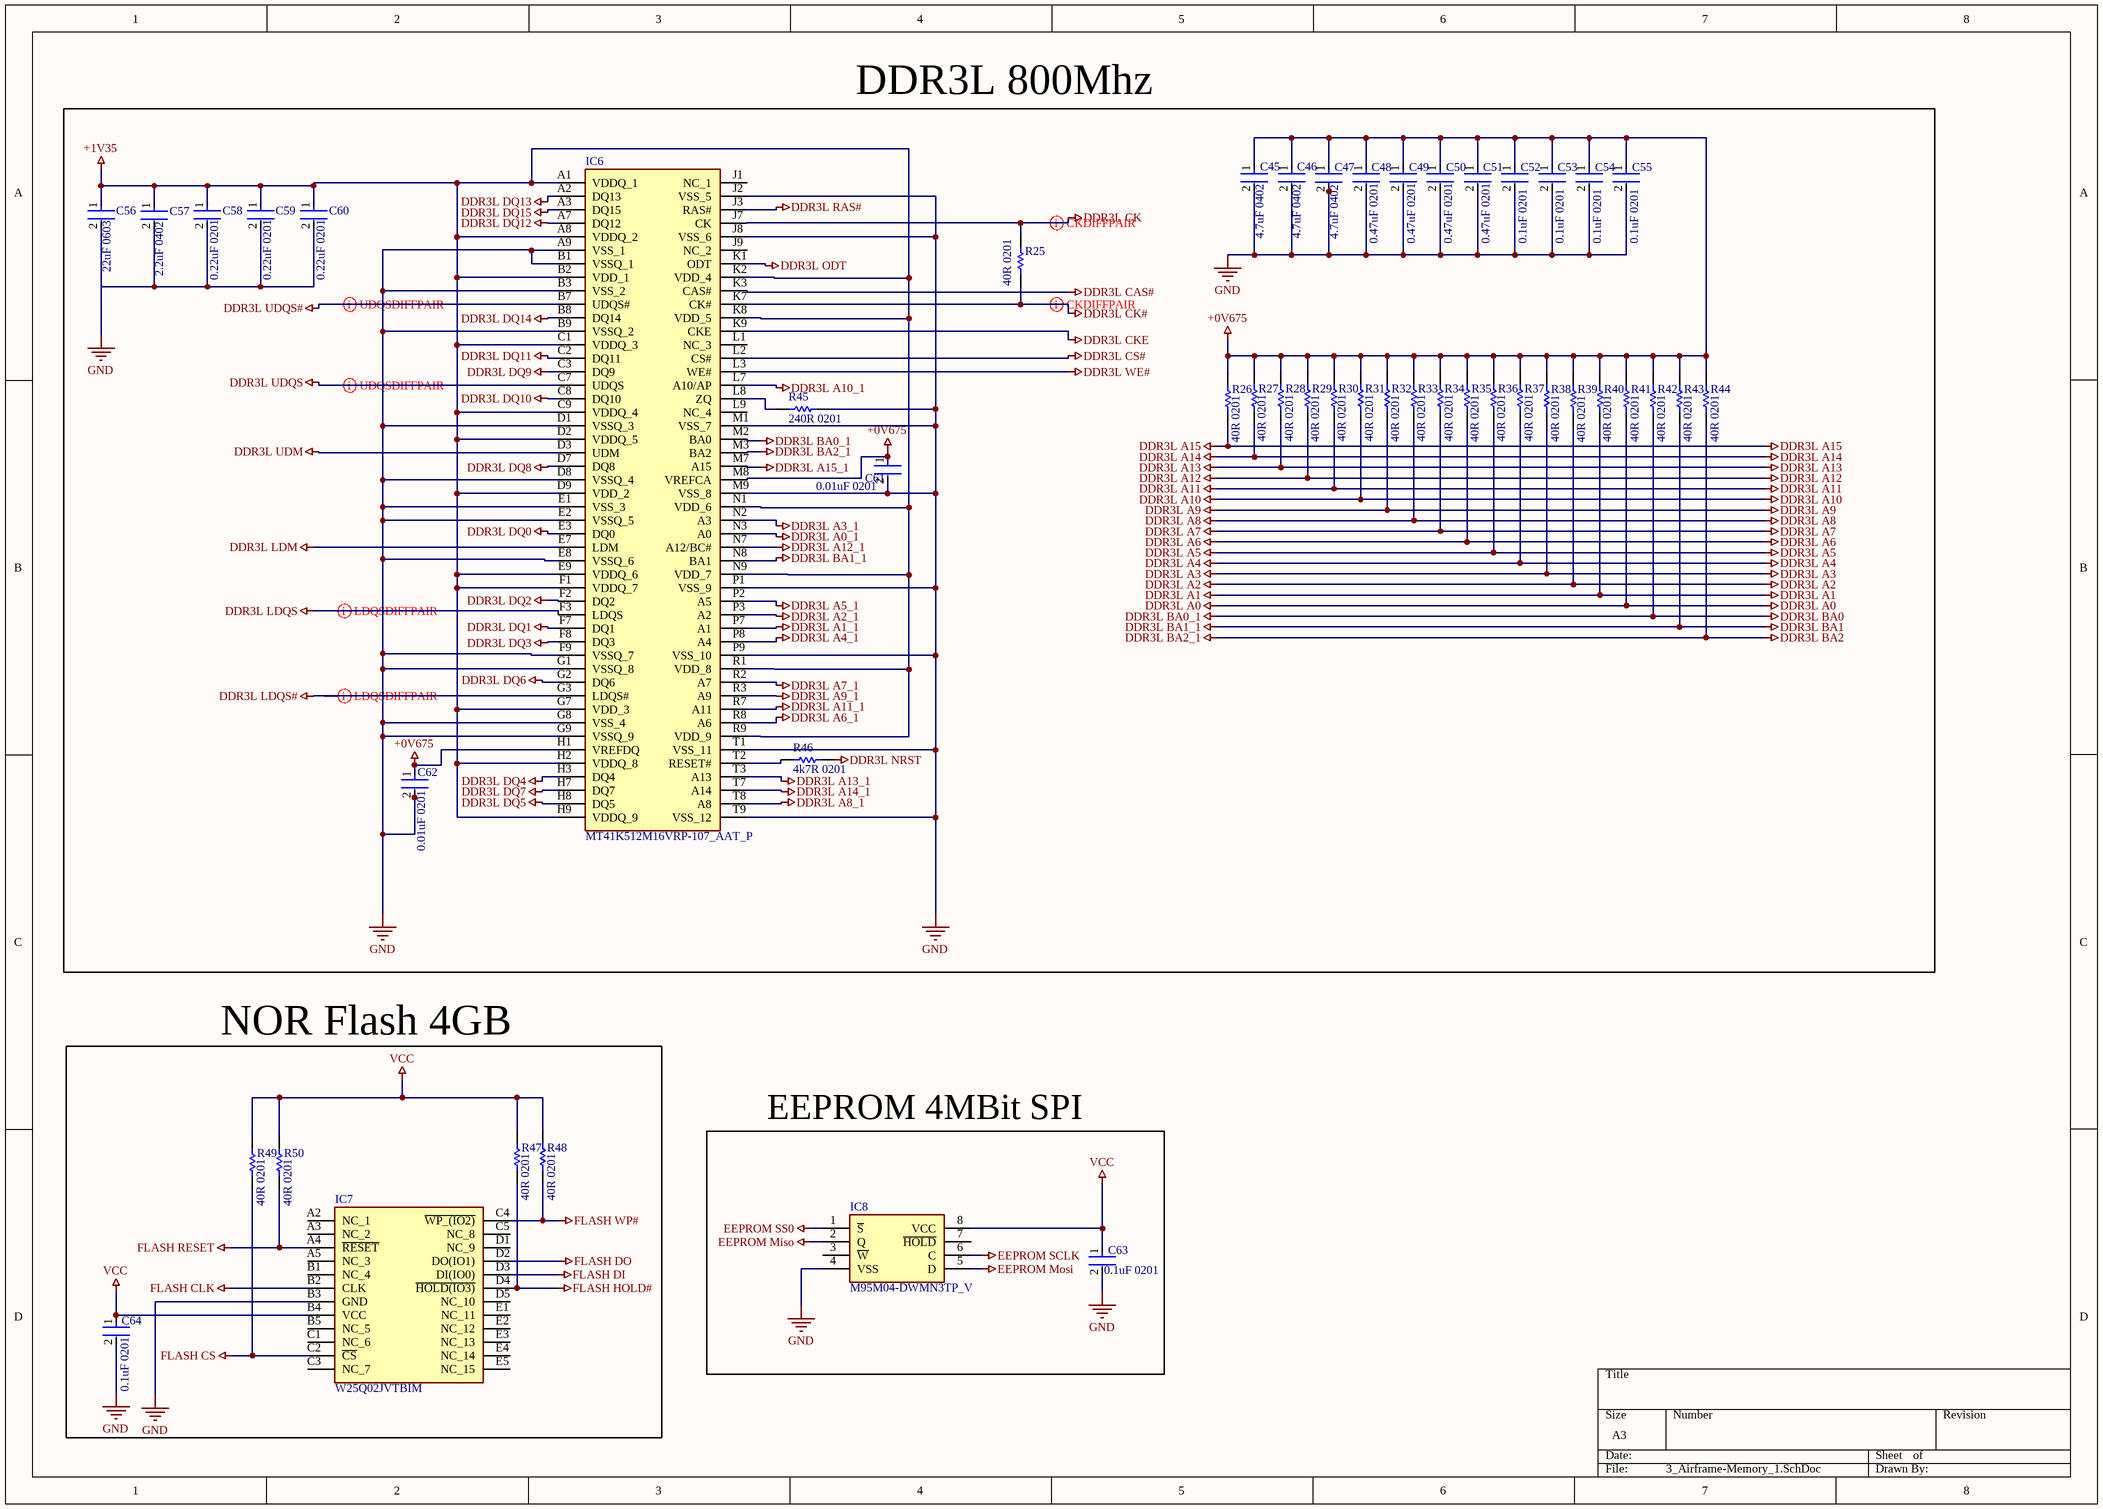
[diagram p3: 3_Airframe-Memory_1.SchDoc]

### Parts
C45  4.7uF 0402  [FP-C0402C225M9PACTU-MFG]
C46  4.7uF 0402  [FP-C0402C225M9PACTU-MFG]
C47  4.7uF 0402  [FP-C0402C225M9PACTU-MFG]
C48  0.47uF 0201  [FP-C0603-030-0_03-IPC_C]
C49  0.47uF 0201  [FP-C0603-030-0_03-IPC_C]
C50  0.47uF 0201  [FP-C0603-030-0_03-IPC_C]
C51  0.47uF 0201  [FP-C0603-030-0_03-IPC_C]
C52  0.1uF 0201  [FP-C0603-030-0_03-IPC_C]
C53  0.1uF 0201  [FP-C0603-030-0_03-IPC_C]
C54  0.1uF 0201  [FP-C0603-030-0_03-IPC_C]
C55  0.1uF 0201  [FP-C0603-030-0_03-IPC_C]
C56  22uF 0603  [FP-GRM188-0_2-IPC_C]
C57  2.2uF 0402  [FP-C0402C225M9PACTU-MFG]
C58  0.22uF 0201  [FP-C0603-030-0_03-IPC_C]
C59  0.22uF 0201  [FP-C0603-030-0_03-IPC_C]
C60  0.22uF 0201  [FP-C0603-030-0_03-IPC_C]
C61  0.01uF 0201  [FP-C0603-030-0_03-IPC_C]
C62  0.01uF 0201  [FP-C0603-030-0_03-IPC_C]
C63  0.1uF 0201  [FP-C0603-030-0_03-IPC_C]
C64  0.1uF 0201  [FP-C0603-030-0_03-IPC_C]
IC6  MT41K512M16VRP-107_AAT_P  [BGA96C80P9X16_800X1400X120]
IC7  W25Q02JVTBIM  [BGA24C100P5X5_600X800X120]
IC8  M95M04-DWMN3TP_V  [SOIC127P600X175-8N]
R25  40R 0201  [RESC0603X28X15NL05T05]
R26  40R 0201  [RESC0603X28X15NL05T05]
R27  40R 0201  [RESC0603X28X15NL05T05]
R28  40R 0201  [RESC0603X28X15NL05T05]
R29  40R 0201  [RESC0603X28X15NL05T05]
R30  40R 0201  [RESC0603X28X15NL05T05]
R31  40R 0201  [RESC0603X28X15NL05T05]
R32  40R 0201  [RESC0603X28X15NL05T05]
R33  40R 0201  [RESC0603X28X15NL05T05]
R34  40R 0201  [RESC0603X28X15NL05T05]
R35  40R 0201  [RESC0603X28X15NL05T05]
R36  40R 0201  [RESC0603X28X15NL05T05]
R37  40R 0201  [RESC0603X28X15NL05T05]
R38  40R 0201  [RESC0603X28X15NL05T05]
R39  40R 0201  [RESC0603X28X15NL05T05]
R40  40R 0201  [RESC0603X28X15NL05T05]
R41  40R 0201  [RESC0603X28X15NL05T05]
R42  40R 0201  [RESC0603X28X15NL05T05]
R43  40R 0201  [RESC0603X28X15NL05T05]
R44  40R 0201  [RESC0603X28X15NL05T05]
R45  240R 0201  [RESC0603X28X15NL05T05]
R46  4k7R 0201  [RESC0603X28X15NL05T05]
R47  40R 0201  [RESC0603X28X15NL05T05]
R48  40R 0201  [RESC0603X28X15NL05T05]
R49  40R 0201  [RESC0603X28X15NL05T05]
R50  40R 0201  [RESC0603X28X15NL05T05]

### Nets
+0V675: C45.1 C46.1 C47.1 C48.1 C49.1 C50.1 C51.1 C52.1 C53.1 C54.1 C55.1 C61.1 C62.1 IC6.H1(VREFDQ) IC6.M8(VREFCA) R26.2 R27.2 R28.2 R29.2 R30.2 R31.2 R32.2 R33.2 R34.2 R35.2 R36.2 R37.2 R38.2 R39.2 R40.2 R41.2 R42.2 R43.2 R44.2
+1V35: C56.1 C57.1 C58.1 C59.1 C60.1 IC6.A1(VDDQ_1) IC6.A8(VDDQ_2) IC6.B2(VDD_1) IC6.C1(VDDQ_3) IC6.C9(VDDQ_4) IC6.D2(VDDQ_5) IC6.D9(VDD_2) IC6.E9(VDDQ_6) IC6.F1(VDDQ_7) IC6.G7(VDD_3) IC6.H2(VDDQ_8) IC6.H9(VDDQ_9) IC6.K2(VDD_4) IC6.K8(VDD_5) IC6.N1(VDD_6) IC6.N9(VDD_7) IC6.R1(VDD_8) IC6.R9(VDD_9)
DDR3L A0: R41.1
DDR3L A0_1: IC6.N3(A0)
DDR3L A1: R40.1
DDR3L A1_1: IC6.P7(A1)
DDR3L A2: R39.1
DDR3L A2_1: IC6.P3(A2)
DDR3L A3: R38.1
DDR3L A3_1: IC6.N2(A3)
DDR3L A4: R37.1
DDR3L A4_1: IC6.P8(A4)
DDR3L A5: R36.1
DDR3L A5_1: IC6.P2(A5)
DDR3L A6: R35.1
DDR3L A6_1: IC6.R8(A6)
DDR3L A7: R34.1
DDR3L A7_1: IC6.R2(A7)
DDR3L A8: R33.1
DDR3L A8_1: IC6.T8(A8)
DDR3L A9: R32.1
DDR3L A9_1: IC6.R3(A9)
DDR3L A10: R31.1
DDR3L A10_1: IC6.L7(A10/AP)
DDR3L A11: R30.1
DDR3L A11_1: IC6.R7(A11)
DDR3L A12: R29.1
DDR3L A12_1: IC6.N7(A12/BC#)
DDR3L A13: R28.1
DDR3L A13_1: IC6.T3(A13)
DDR3L A14: R27.1
DDR3L A14_1: IC6.T7(A14)
DDR3L A15: R26.1
DDR3L A15_1: IC6.M7(A15)
DDR3L BA0: IC6.M2(BA0) R42.1  [also labelled DDR3L BA0_1]
DDR3L BA1: IC6.N8(BA1) R43.1  [also labelled DDR3L BA1_1]
DDR3L BA2: IC6.M3(BA2) R44.1  [also labelled DDR3L BA2_1]
DDR3L CAS#: IC6.K3(CAS#)
DDR3L CK: IC6.J7(CK) R25.2
DDR3L CK#: IC6.K7(CK#) R25.1
DDR3L CKE: IC6.K9(CKE)
DDR3L CS#: IC6.L2(CS#)
DDR3L DQ0: IC6.E3(DQ0)
DDR3L DQ1: IC6.F7(DQ1)
DDR3L DQ2: IC6.F2(DQ2)
DDR3L DQ3: IC6.F8(DQ3)
DDR3L DQ4: IC6.H3(DQ4)
DDR3L DQ5: IC6.H8(DQ5)
DDR3L DQ6: IC6.G2(DQ6)
DDR3L DQ7: IC6.H7(DQ7)
DDR3L DQ8: IC6.D7(DQ8)
DDR3L DQ9: IC6.C3(DQ9)
DDR3L DQ10: IC6.C8(DQ10)
DDR3L DQ11: IC6.C2(DQ11)
DDR3L DQ12: IC6.A7(DQ12)
DDR3L DQ13: IC6.A2(DQ13)
DDR3L DQ14: IC6.B8(DQ14)
DDR3L DQ15: IC6.A3(DQ15)
DDR3L LDM: IC6.E7(LDM)
DDR3L LDQS: IC6.F3(LDQS)
DDR3L LDQS#: IC6.G3(LDQS#)
DDR3L NRST: R46.2
DDR3L ODT: IC6.K1(ODT)
DDR3L RAS#: IC6.J3(RAS#)
DDR3L UDM: IC6.D3(UDM)
DDR3L UDQS: IC6.C7(UDQS)
DDR3L UDQS#: IC6.B7(UDQS#)
DDR3L WE#: IC6.L3(WE#)
EEPROM Miso: IC8.2(Q)
EEPROM Mosi: IC8.5(D)
EEPROM SCLK: IC8.6(C)
EEPROM SS0: IC8.1(~{S})
FLASH CLK: IC7.B2(CLK)
FLASH CS: IC7.C2(~{CS}) R49.1
FLASH DI: IC7.D3(DI(IO0))
FLASH DO: IC7.D2(DO(IO1))
FLASH HOLD#: IC7.D4(~{HOLD(IO3)}) R47.1
FLASH RESET: IC7.A4(~{RESET}) R50.1
FLASH WP#: IC7.C4(~{WP_(IO2)}) R48.1
GND: C45.2 C46.2 C47.2 C48.2 C49.2 C50.2 C51.2 C52.2 C53.2 C54.2 C55.2 C56.2 C57.2 C58.2 C59.2 C60.2 C61.2 C62.2 C63.2 C64.2 IC6.A9(VSS_1) IC6.B1(VSSQ_1) IC6.B3(VSS_2) IC6.B9(VSSQ_2) IC6.D1(VSSQ_3) IC6.D8(VSSQ_4) IC6.E1(VSS_3) IC6.E2(VSSQ_5) IC6.E8(VSSQ_6) IC6.F9(VSSQ_7) IC6.G1(VSSQ_8) IC6.G8(VSS_4) IC6.G9(VSSQ_9) IC6.J2(VSS_5) IC6.J8(VSS_6) IC6.M1(VSS_7) IC6.M9(VSS_8) IC6.P1(VSS_9) IC6.P9(VSS_10) IC6.T1(VSS_11) IC6.T9(VSS_12) IC7.B3(GND) IC8.4(VSS) R45.2  [project net CTR]
VCC: C63.1 C64.1 IC7.B4(VCC) IC8.8(VCC) R47.2 R48.2 R49.2 R50.2  [project net +VS]
NetIC6_L8: IC6.L8(ZQ) R45.1
NetIC6_T2: IC6.T2(RESET#) R46.1

Not connected (* = marked no-connect by the designer): IC6 J1(NC_1) J9(NC_2) L1(NC_3) L9(NC_4); IC7 A2(NC_1) A3(NC_2) A5(NC_3) B1(NC_4) B5(NC_5) C1(NC_6) C3(NC_7) C5(NC_8) D1(NC_9) D5(NC_10) E1(NC_11) E2(NC_12) E3(NC_13) E4(NC_14) E5(NC_15); IC8 3(~{W}) 7(~{HOLD})

### Layout directives
differential pair: DDR3L CK, DDR3L CK#, DDR3L LDQS, DDR3L LDQS#, DDR3L UDQS, DDR3L UDQS#

### Notes on the sheet
- DDR3L 800Mhz
- NOR Flash 4GB
- EEPROM 4MBit SPI

### Library data of the parts
C45-C47 C57 = CMP-2008-02064-3: CAP CER 2.2UF 6.3V X5R 0402; Tolerance: 20%; Dissipation Factor: 5%; Dielectric Material: Ceramic; Lead Free: Lead Free; Depth: 0.5mm; Series: C; Termination: SMD/SMT; Case Code (Metric): 1005; Case/Package: 0402; Dielectric: X5R; RoHS Compliant: Yes; Thickness: 0.022inch; Voltage Rating: 6.3V; Voltage: 6.3V; Height: 0.5mm; Mount: Surface Mount; Construction: Flat; Case Code (Imperial): 0402; Min Operating Temperature: -55°C; Contact Plating: Tin; Radiation Hardening: No; Number of Pins: 2; Voltage Rating (DC): 6.3V; Capacitance: 2.2uF; Width: 0.5mm; Package Quantity: 1; Packaging: Tape and Reel; Max Operating Temperature: 85°C; Length: 1mm; REACH SVHC: No SVHC
C48-C55 C58-C64 = CMP-08246-007095-1: Multilayer Ceramic Capacitors 220nF ±10% 6.3V X6S SMD 0201; Dielectric: X6S; Resistor Type: Ceramic; Length: 0.6mm; Capacitance: 220nF; Case Code (Metric): 0603; Series: C; Width: 0.012inch; Height: 0.3mm; Voltage Rating: 6.3V; Max Operating Temperature: 105°C; REACH SVHC: No SVHC; RoHS Compliant: Yes; Tolerance: 10%; Termination: SMD/SMT; Case/Package: 0201; Case Code (Imperial): 0201; Weight: 6E-06oz; Lead Free: Lead Free; Construction: Flat; Thickness: 300um; Mount: Surface Mount; Dielectric Material: Ceramic; Voltage Rating (DC): 6.3V; Packaging: Cut Tape; Package Quantity: 1; Min Operating Temperature: -55°C; Depth: 0.3mm
C56 = CMP-2000-06337-3: as C7 on sheet 2_Airframe-Power_2; Tolerance: 20%; Weight: 0.000222oz; Material: Ceramic; Depth: 0.8mm; Length: 1.6mm; Termination: SMD/SMT; Capacitance: 22uF; Packaging: Tape and Reel; Width: 0.8mm; Voltage Rating: 10V; Case Code (Imperial): 0603; Mount: Surface Mount; Voltage Rating (DC): 10V; Case/Package: 0603; Thickness: 0.039inch; REACH SVHC: No SVHC; Dielectric: X5R; Height: 0.8mm; Package Quantity: 4000; Case Code (Metric): 1608; Min Operating Temperature: -55°C; Lead Free: Lead Free; Max Operating Temperature: 85°C
IC6 = MT41K512M16VRP-107_AAT_P: Integrated Circuit; Manufacturer_Name: Micron; Manufacturer_Part_Number: MT41K512M16VRP-107 AAT:P; Datasheet Link: https://media-www.micron.com/-/media/client/global/documents/products/data-sheet/dram/ddr3/ddr3l_8gb_x16_1cs_twindie_v00h.pdf?rev=22af12ce29de4defa41e06e9beebd61f; Height: 1.2mm; Mouser Part Number: 340-446578-TRAY; Mouser Price/Stock: https://www.mouser.co.uk/ProductDetail/Micron/MT41K512M16VRP-107-AATP?qs=vHuUswq2%252Bsx8WmnHcfGgyw%3D%3D; Arrow Part Number: MT41K512M16VRP-107 AAT:P; Arrow Price/Stock: https://www.arrow.com/en/products/mt41k512m16vrp-107-aatp/micron-technology?region=nac
IC7 = W25Q02JVTBIM: Integrated Circuit; Manufacturer_Name: Winbond; Datasheet Link: https://www.mouser.com/datasheet/2/949/W25Q02JV_DTR_RevB_04192021-2329042.pdf; Height: 1.2mm; Manufacturer_Part_Number: W25Q02JVTBIM; Mouser Part Number: 454-W25Q02JVTBIM; Mouser Price/Stock: https://www.mouser.co.uk/ProductDetail/Winbond/W25Q02JVTBIM?qs=TuK3vfAjtkVTVCDKxnTswg%3D%3D; Arrow Part Number: W25Q02JVTBIM; Arrow Price/Stock: https://www.arrow.com/en/products/w25q02jvtbim/winbond-electronics?region=nac
IC8 = M95M04-DWMN3TP_V: Integrated Circuit; Manufacturer_Name: STMicroelectronics; Manufacturer_Part_Number: M95M04-DWMN3TP/V; Datasheet Link: https://www.st.com/resource/en/datasheet/dm00345675.pdf; Height: 1.75mm; Mouser Part Number: 511-M95M04-DWMN3TP/V; Mouser Price/Stock: https://www.mouser.co.uk/ProductDetail/STMicroelectronics/M95M04-DWMN3TP-V?qs=Jslch3jnSjmvFWprUQ0dSQ%3D%3D; Arrow Part Number: M95M04-DWMN3TP/V; Arrow Price/Stock: https://www.arrow.com/en/products/m95m04-dwmn3tpv/stmicroelectronics?region=nac
R25-R50 = CMP-2004-00006-1: Manufacturer: Vishay; Part Number: CRCW0201100RFNED

## Sheet 5_Airframe-NXP_i.MX7_Power.SchDoc
size A2; SheetNumber: 5; SheetTotal: 9
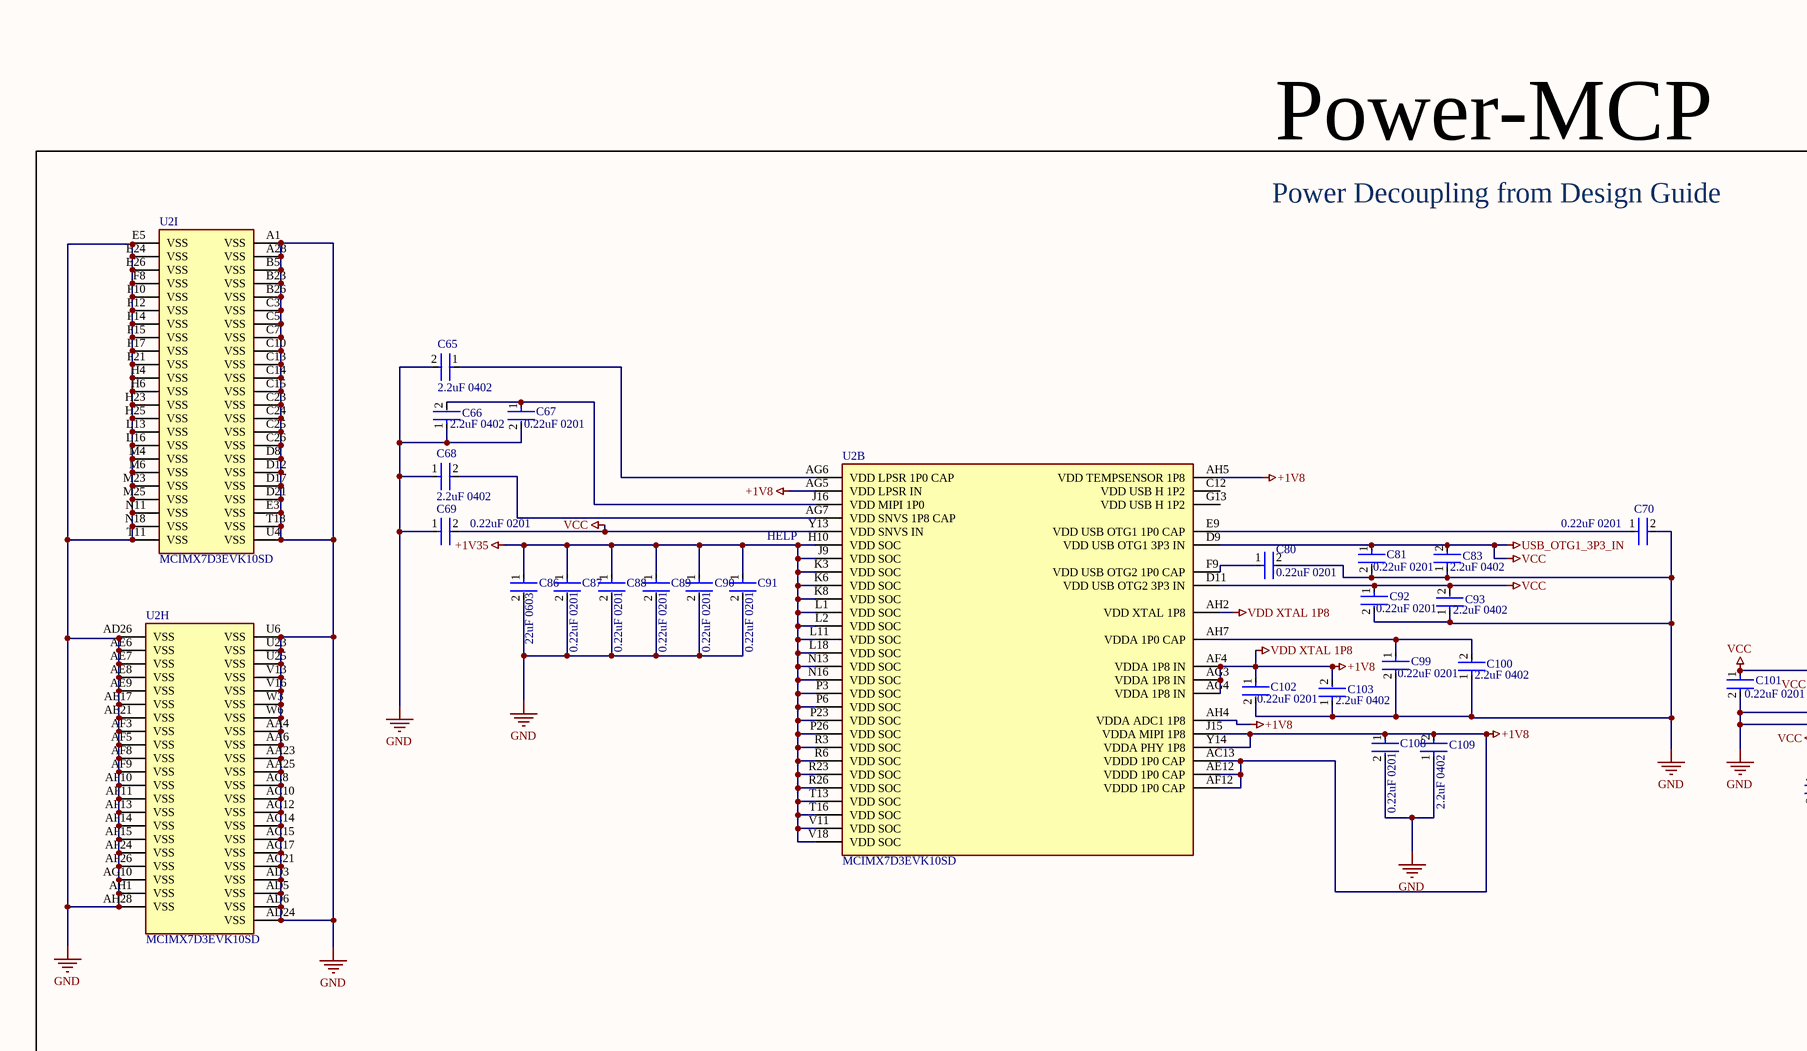
[diagram p4: 5_Airframe-NXP_i.MX7_Power.SchDoc, left]
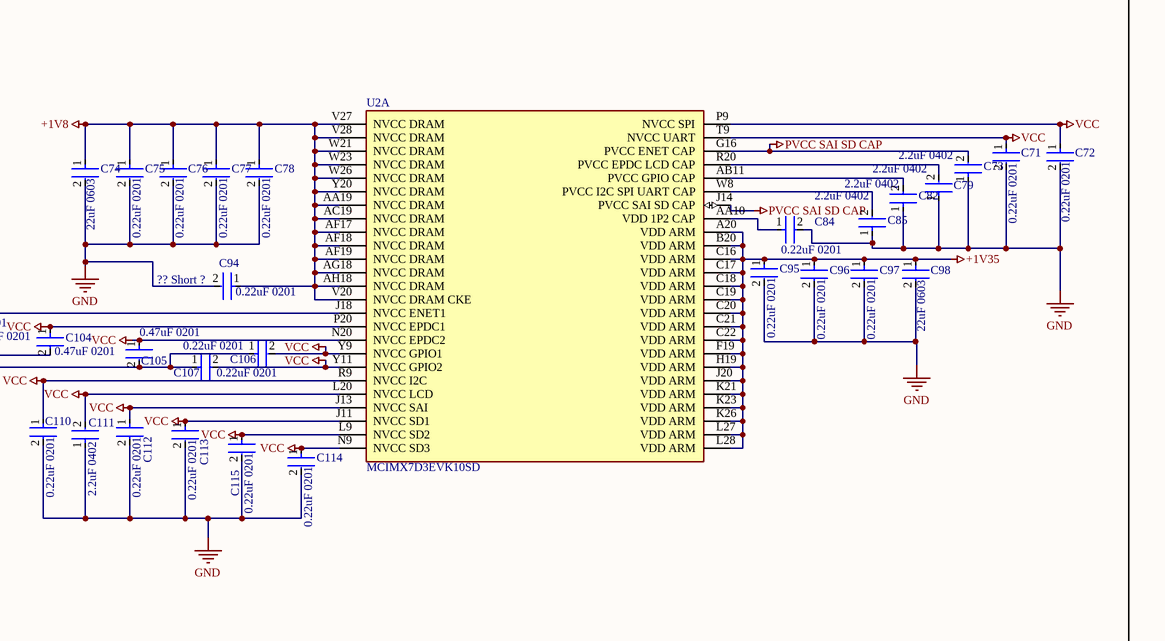
[diagram p5: 5_Airframe-NXP_i.MX7_Power.SchDoc, right]

### Parts
C65  2.2uF 0402  [FP-C0402C225M9PACTU-MFG]
C66  2.2uF 0402  [FP-C0402C225M9PACTU-MFG]
C67  0.22uF 0201  [FP-C0603-030-0_03-IPC_C]
C68  2.2uF 0402  [FP-C0402C225M9PACTU-MFG]
C69  0.22uF 0201  [FP-C0603-030-0_03-IPC_C]
C70  0.22uF 0201  [FP-C0603-030-0_03-IPC_C]
C71  0.22uF 0201  [FP-C0603-030-0_03-IPC_C]
C72  0.22uF 0201  [FP-C0603-030-0_03-IPC_C]
C73  2.2uF 0402  [FP-C0402C225M9PACTU-MFG]
C74  22uF 0603  [FP-GRM188-0_2-IPC_C]
C75  0.22uF 0201  [FP-C0603-030-0_03-IPC_C]
C76  0.22uF 0201  [FP-C0603-030-0_03-IPC_C]
C77  0.22uF 0201  [FP-C0603-030-0_03-IPC_C]
C78  0.22uF 0201  [FP-C0603-030-0_03-IPC_C]
C79  2.2uF 0402  [FP-C0402C225M9PACTU-MFG]
C80  0.22uF 0201  [FP-C0603-030-0_03-IPC_C]
C81  0.22uF 0201  [FP-C0603-030-0_03-IPC_C]
C82  2.2uF 0402  [FP-C0402C225M9PACTU-MFG]
C83  2.2uF 0402  [FP-C0402C225M9PACTU-MFG]
C84  0.22uF 0201  [FP-C0603-030-0_03-IPC_C]
C85  2.2uF 0402  [FP-C0402C225M9PACTU-MFG]
C86  22uF 0603  [FP-GRM188-0_2-IPC_C]
C87  0.22uF 0201  [FP-C0603-030-0_03-IPC_C]
C88  0.22uF 0201  [FP-C0603-030-0_03-IPC_C]
C89  0.22uF 0201  [FP-C0603-030-0_03-IPC_C]
C90  0.22uF 0201  [FP-C0603-030-0_03-IPC_C]
C91  0.22uF 0201  [FP-C0603-030-0_03-IPC_C]
C92  0.22uF 0201  [FP-C0603-030-0_03-IPC_C]
C93  2.2uF 0402  [FP-C0402C225M9PACTU-MFG]
C94  0.22uF 0201  [FP-C0603-030-0_03-IPC_C]
C95  0.22uF 0201  [FP-C0603-030-0_03-IPC_C]
C96  0.22uF 0201  [FP-C0603-030-0_03-IPC_C]
C97  0.22uF 0201  [FP-C0603-030-0_03-IPC_C]
C98  22uF 0603  [FP-GRM188-0_2-IPC_C]
C99  0.22uF 0201  [FP-C0603-030-0_03-IPC_C]
C100  2.2uF 0402  [FP-C0402C225M9PACTU-MFG]
C101  0.22uF 0201  [FP-C0603-030-0_03-IPC_C]
C102  0.22uF 0201  [FP-C0603-030-0_03-IPC_C]
C103  2.2uF 0402  [FP-C0402C225M9PACTU-MFG]
C104  0.47uF 0201  [FP-C0603-030-0_03-IPC_C]
C105  0.47uF 0201  [FP-C0603-030-0_03-IPC_C]
C106  0.22uF 0201  [FP-C0603-030-0_03-IPC_C]
C107  0.22uF 0201  [FP-C0603-030-0_03-IPC_C]
C108  0.22uF 0201  [FP-C0603-030-0_03-IPC_C]
C109  2.2uF 0402  [FP-C0402C225M9PACTU-MFG]
C110  0.22uF 0201  [FP-C0603-030-0_03-IPC_C]
C111  2.2uF 0402  [FP-C0402C225M9PACTU-MFG]
C112  0.22uF 0201  [FP-C0603-030-0_03-IPC_C]
C113  0.22uF 0201  [FP-C0603-030-0_03-IPC_C]
C114  0.22uF 0201  [FP-C0603-030-0_03-IPC_C]
C115  0.22uF 0201  [FP-C0603-030-0_03-IPC_C]
U2  MCIMX7D3EVK10SD  [FP-SOT1839-1-IPC_C]  (parts A,B,H,I of 9)

### Nets
+1V8: C74.1 C75.1 C76.1 C77.1 C78.1 C94.1 C102.1 C103.2 C108.1 C109.2 U2.AA19(NVCC_DRAM) U2.AC13(VDDD_1P0_CAP) U2.AC19(NVCC_DRAM) U2.AE12(VDDD_1P0_CAP) U2.AF4(VDDA_1P8_IN) U2.AF12(VDDD_1P0_CAP) U2.AF17(NVCC_DRAM) U2.AF18(NVCC_DRAM) U2.AF19(NVCC_DRAM) U2.AG3(VDDA_1P8_IN) U2.AG4(VDDA_1P8_IN) U2.AG5(VDD_LPSR_IN) U2.AG18(NVCC_DRAM) U2.AH2(VDD_XTAL_1P8) U2.AH4(VDDA_ADC1_1P8) U2.AH5(VDD_TEMPSENSOR_1P8) U2.AH18(NVCC_DRAM) U2.J15(VDDA_MIPI_1P8) U2.V20(NVCC_DRAM_CKE) U2.V27(NVCC_DRAM) U2.V28(NVCC_DRAM) U2.W21(NVCC_DRAM) U2.W23(NVCC_DRAM) U2.W26(NVCC_DRAM) U2.Y14(VDDA_PHY_1P8) U2.Y20(NVCC_DRAM)  [also labelled VDD XTAL 1P8]
+1V35: C86.1 C87.1 C88.1 C89.1 C90.1 C91.1 C95.1 C96.1 C97.1 C98.1 U2.A20(VDD_ARM) U2.B20(VDD_ARM) U2.C16(VDD_ARM) U2.C17(VDD_ARM) U2.C18(VDD_ARM) U2.C19(VDD_ARM) U2.C20(VDD_ARM) U2.C21(VDD_ARM) U2.C22(VDD_ARM) U2.F19(VDD_ARM) U2.H10(VDD_SOC) U2.H19(VDD_ARM) U2.J9(VDD_SOC) U2.J20(VDD_ARM) U2.K3(VDD_SOC) U2.K6(VDD_SOC) U2.K8(VDD_SOC) U2.K21(VDD_ARM) U2.K23(VDD_ARM) U2.K26(VDD_ARM) U2.L1(VDD_SOC) U2.L2(VDD_SOC) U2.L11(VDD_SOC) U2.L18(VDD_SOC) U2.L27(VDD_ARM) U2.L28(VDD_ARM) U2.N13(VDD_SOC) U2.N16(VDD_SOC) U2.P3(VDD_SOC) U2.P6(VDD_SOC) U2.P23(VDD_SOC) U2.P26(VDD_SOC) U2.R3(VDD_SOC) U2.R6(VDD_SOC) U2.R23(VDD_SOC) U2.R26(VDD_SOC) U2.T13(VDD_SOC) U2.T16(VDD_SOC) U2.V11(VDD_SOC) U2.V18(VDD_SOC)
GND: C65.2 C66.1 C67.2 C68.1 C69.1 C70.2 C71.2 C72.2 C73.1 C74.2 C75.2 C76.2 C77.2 C78.2 C79.1 C80.2 C81.2 C82.1 C83.1 C84.2 C85.1 C86.2 C87.2 C88.2 C89.2 C90.2 C91.2 C92.2 C93.1 C94.2 C95.2 C96.2 C97.2 C98.2 C99.2 C100.1 C101.2 C102.2 C103.1 C104.2 C105.2 C106.1 C107.1 C108.2 C109.1 C110.2 C111.1 C112.2 C113.2 C114.2 C115.2 U2.A1(VSS) U2.A28(VSS) U2.AA4(VSS) U2.AA6(VSS) U2.AA23(VSS) U2.AA25(VSS) U2.AC8(VSS) U2.AC10(VSS) U2.AC12(VSS) U2.AC14(VSS) U2.AC15(VSS) U2.AC17(VSS) U2.AC21(VSS) U2.AD3(VSS) U2.AD5(VSS) U2.AD6(VSS) U2.AD24(VSS) U2.AD26(VSS) U2.AE6(VSS) U2.AE7(VSS) U2.AE8(VSS) U2.AE9(VSS) U2.AE17(VSS) U2.AE21(VSS) U2.AF3(VSS) U2.AF5(VSS) U2.AF8(VSS) U2.AF9(VSS) U2.AF10(VSS) U2.AF11(VSS) U2.AF13(VSS) U2.AF14(VSS) U2.AF15(VSS) U2.AF24(VSS) U2.AF26(VSS) U2.AG10(VSS) U2.AH1(VSS) U2.AH28(VSS) U2.B5(VSS) U2.B23(VSS) U2.B26(VSS) U2.C3(VSS) U2.C5(VSS) U2.C7(VSS) U2.C10(VSS) U2.C13(VSS) U2.C14(VSS) U2.C15(VSS) U2.C23(VSS) U2.C24(VSS) U2.C25(VSS) U2.C26(VSS) U2.D8(VSS) U2.D12(VSS) U2.D17(VSS) U2.D21(VSS) U2.E3(VSS) U2.E5(VSS) U2.E24(VSS) U2.E26(VSS) U2.F8(VSS) U2.F10(VSS) U2.F12(VSS) U2.F14(VSS) U2.F15(VSS) U2.F17(VSS) U2.F21(VSS) U2.H4(VSS) U2.H6(VSS) U2.H23(VSS) U2.H25(VSS) U2.L13(VSS) U2.L16(VSS) U2.M4(VSS) U2.M6(VSS) U2.M23(VSS) U2.M25(VSS) U2.N11(VSS) U2.N18(VSS) U2.T11(VSS) U2.T18(VSS) U2.U4(VSS) U2.U6(VSS) U2.U23(VSS) U2.U25(VSS) U2.V13(VSS) U2.V16(VSS) U2.W3(VSS) U2.W6(VSS)  [project net CTR]
PVCC SAI SD CAP: C73.2 U2.G16(PVCC_ENET_CAP) U2.J14(PVCC_SAI_SD_CAP)
USB_OTG1_3P3_IN: C69.2 C71.1 C72.1 C81.1 C83.2 C92.1 C93.2 C101.1 C104.1 C105.1 C106.2 C107.2 C110.1 C111.2 C112.1 C113.1 C114.1 C115.1 U2.D9(VDD_USB_OTG1_3P3_IN) U2.D11(VDD_USB_OTG2_3P3_IN) U2.J11(NVCC_SD1) U2.J13(NVCC_SAI) U2.J18(NVCC_ENET1) U2.L9(NVCC_SD2) U2.L20(NVCC_LCD) U2.N9(NVCC_SD3) U2.N20(NVCC_EPDC2) U2.P9(NVCC_SPI) U2.P20(NVCC_EPDC1) U2.R9(NVCC_I2C) U2.T9(NVCC_UART) U2.Y9(NVCC_GPIO1) U2.Y11(NVCC_GPIO2) U2.Y13(VDD_SNVS_IN)  [also labelled VCC]  [project net +VS]
NetC65_1: C65.1 U2.AG6(VDD_LPSR_1P0_CAP)
NetC66_2: C66.2 C67.1 U2.J16(VDD_MIPI_1P0)
NetC68_2: C68.2 U2.AG7(VDD_SNVS_1P8_CAP)
NetC70_1: C70.1 U2.E9(VDD_USB_OTG1_1P0_CAP)
NetC79_2: C79.2 U2.R20(PVCC_EPDC_LCD_CAP)
NetC80_1: C80.1 U2.F9(VDD_USB_OTG2_1P0_CAP)
NetC82_2: C82.2 U2.AB11(PVCC_GPIO_CAP)
NetC84_1: C84.1 U2.AA10(VDD_1P2_CAP)
NetC85_2: C85.2 U2.W8(PVCC_I2C_SPI_UART_CAP)
NetC99_1: C99.1 C100.2 U2.AH7(VDDA_1P0_CAP)

Not connected (* = marked no-connect by the designer): U2 C12(VDD_USB_H_1P2) G13(VDD_USB_H_1P2)

### Notes on the sheet
- Power-MCP
- Power Decoupling from Design Guide
- HELP
- (near C94) ?? Short ?

### Library data of the parts
C65 C66 C68 C73 C79 C82 C83 C85 C93 C100 C103 C109 C111 = CMP-2008-02064-3: as C45 on sheet 3_Airframe-Memory_1; Lead Free: Lead Free; Depth: 0.5mm; Series: C; Termination: SMD/SMT; Case Code (Metric): 1005; Case/Package: 0402; Dielectric: X5R; RoHS Compliant: Yes; Thickness: 0.022inch; Voltage Rating: 6.3V; Voltage: 6.3V; Height: 0.5mm; Mount: Surface Mount; Construction: Flat; Case Code (Imperial): 0402; Min Operating Temperature: -55°C; Contact Plating: Tin; Radiation Hardening: No; Number of Pins: 2; Voltage Rating (DC): 6.3V; Capacitance: 2.2uF; Width: 0.5mm; Package Quantity: 1; Packaging: Tape and Reel; Max Operating Temperature: 85°C; Length: 1mm; REACH SVHC: No SVHC
C67 C69-C72 C75-C78 C80 C81 C84 C87-C92 C94-C97 C99 C101 C102 C104-C108 C110 C112-C115 = CMP-08246-007095-1: as C48 on sheet 3_Airframe-Memory_1; Dielectric: X6S; Resistor Type: Ceramic; Length: 0.6mm; Capacitance: 220nF; Case Code (Metric): 0603; Series: C; Width: 0.012inch; Height: 0.3mm; Voltage Rating: 6.3V; Max Operating Temperature: 105°C; REACH SVHC: No SVHC; RoHS Compliant: Yes; Tolerance: 10%; Termination: SMD/SMT; Case/Package: 0201; Case Code (Imperial): 0201; Weight: 6E-06oz; Lead Free: Lead Free; Construction: Flat; Thickness: 300um; Mount: Surface Mount; Dielectric Material: Ceramic; Voltage Rating (DC): 6.3V; Packaging: Cut Tape; Package Quantity: 1; Min Operating Temperature: -55°C; Depth: 0.3mm
C74 C86 C98 = CMP-2000-06337-3: as C7 on sheet 2_Airframe-Power_2; Tolerance: 20%; Weight: 0.000222oz; Material: Ceramic; Depth: 0.8mm; Length: 1.6mm; Termination: SMD/SMT; Capacitance: 22uF; Packaging: Tape and Reel; Width: 0.8mm; Voltage Rating: 10V; Case Code (Imperial): 0603; Mount: Surface Mount; Voltage Rating (DC): 10V; Case/Package: 0603; Thickness: 0.039inch; REACH SVHC: No SVHC; Dielectric: X5R; Height: 0.8mm; Package Quantity: 4000; Case Code (Metric): 1608; Min Operating Temperature: -55°C; Lead Free: Lead Free; Max Operating Temperature: 85°C
U2 = CMP-10096-000008-1: I.MX 7DUAL: REV 1.3; Manufacturer: NXP; Number Of I2C Channels: 4; Number Of Timers/Counters: 11; Nominal Supply Current: 1-1000mA; Max Junction Temp: +105°C; Number Of Uart Channels: 7; Number Of Cores: 2; Interface: I2C,SPI,UART,USB,Ethernet,I2S,LVDS,PCIe,Other; Ram Size: 256KBytes; Data Bus Width: 32bits; Number Of Usb Channels: 3; Number Of Adc Channels: 1; Standoff Height: 0.13mm; Frequency: 1GHz; Max Supply Voltage: 3.6V; Core Architecture: Arm Cortex-A7; Number Of Spi Channels: 5; Memory Type: FLASH,NAND,DDR2,DDR3,OTHER; Min Supply Voltage: 0.95V; ComponentLink2URL: https://www.nxp.com/docs/en/data-sheet/IMX7DCEC.pdf; Number Of Pwm Channels: 4; Package: SOT1839-1; Temperature: -20°C to +105°C; Footprint Url: https://www.nxp.com/docs/en/package-information/98ASA00727D.pdf; RoHS: TRUE; Temperature Range Low: -20°C; Lead Free: Yes; Category: IC; Ipc Land Pattern Name: BGA784N40P28X28_1200X1200X110; Device Class L3: Microprocessors; Mouser Description: i.MX 7Dual: 2x Cortex A7, 2x USB 2.0 OTG with PHY, PCIe, 2xSDIO/MMC, 2x Ethernet, Security; ComponentLink2Description: Datasheet; Manufacturer Part Number: MCIMX7D3EVK10SD; Octopart: https://octopart.com/mcimx7d3evk10sd-nxp+semiconductors-84356608; Digikey Description: I.MX 7DUAL: REV 1.3; Device Class L1: Integrated Circuits (ICs); Temperature Range High: +105°C; Height: 1.1mm; Automotive: No; Number Of Ethernet Channels: 2; Number Of A/D Converters: 1; Device Class L2: Embedded Processors and Controllers